# Altium project MotherBoard.PrjPcb (part 1 of 2)
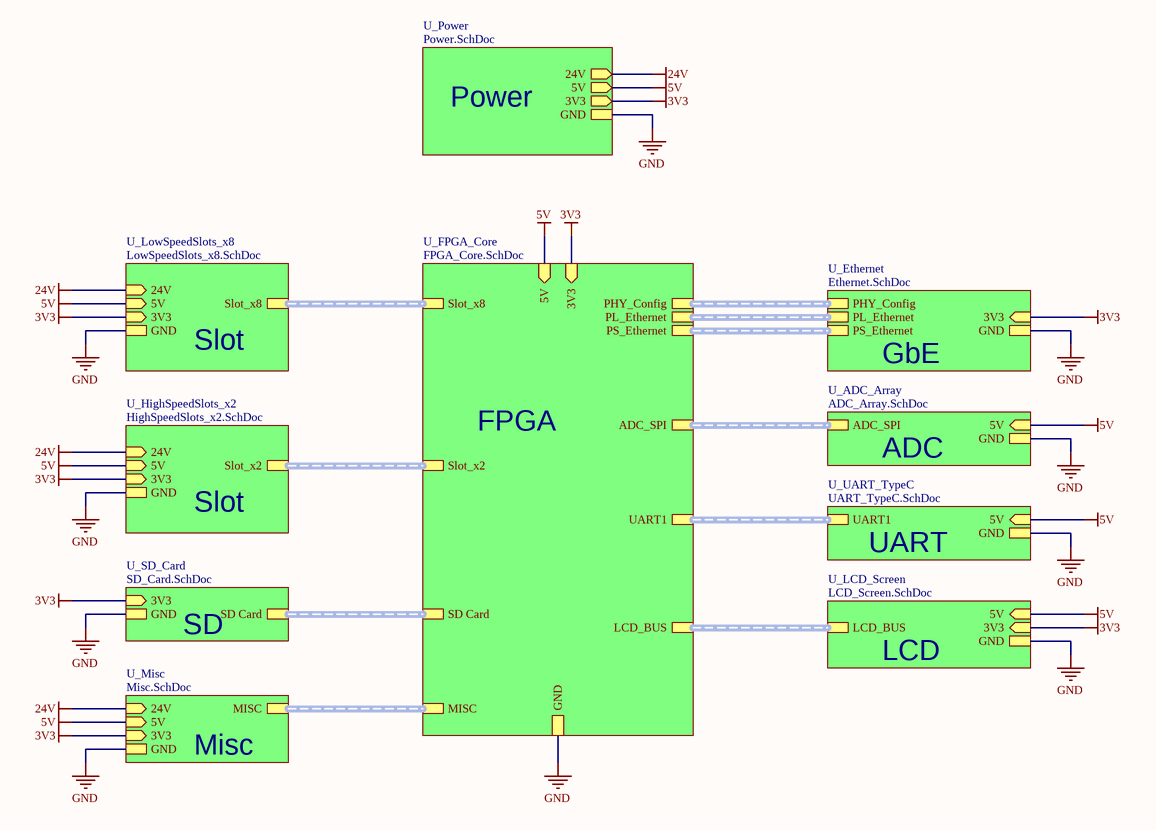
[diagram p0: MotherBoard.SchDoc]
Version: 1.1 (TO); RepoURL: https://github.com/hkust-fiona/fiona-hardware.git; Project: FIONA Toolchain (Mother Board); License: Light the Way Forward :D; DescriptionLine2: hkust-fiona/; DescriptionLine1: https://github.com/; Date: Aug 31, 2022; Author: Yinyi (Shannon) LIU
16 sheets, 213 parts. Net scope: strictly hierarchical (ports join the sheet entries above them; power ports are local).
Board file: PCB_MotherBoard.PcbDoc
Sheets:
  MotherBoard.SchDoc
    U_Power = Power.SchDoc
      U_24V_Supply = 24V_Supply.SchDoc
      U_5V_and_3V3 = 5V_and_3V3.SchDoc
    U_LowSpeedSlots_x8 = LowSpeedSlots_x8.SchDoc
      U_CardSlot1 = CardSlot.SchDoc
      U_CardSlot2 = CardSlot.SchDoc
      U_CardSlot3 = CardSlot.SchDoc
      U_CardSlot4 = CardSlot.SchDoc
      U_CardSlot5 = CardSlot.SchDoc
      U_CardSlot6 = CardSlot.SchDoc
      U_CardSlot7 = CardSlot.SchDoc
      U_CardSlot8 = CardSlot.SchDoc
    U_HighSpeedSlots_x2 = HighSpeedSlots_x2.SchDoc
      U_CardSlot9 = CardSlot.SchDoc
      U_CardSlot10 = CardSlot.SchDoc
    U_FPGA_Core = FPGA_Core.SchDoc
    U_Ethernet = Ethernet.SchDoc
      U_PS_RJ45 = PS_RJ45.SchDoc
      U_PL_PHY_RJ45 = PL_PHY_RJ45.SchDoc
    U_ADC_Array = ADC_Array.SchDoc
    U_UART_TypeC = UART_TypeC.SchDoc
    U_SD_Card = SD_Card.SchDoc
    U_LCD_Screen = LCD_Screen.SchDoc
    U_Misc = Misc.SchDoc

## Sheet MotherBoard.SchDoc: Mother Board
size A4; ENG_APP_DATE: --/--/--; DSN_APP_DATE: --/--/--; CHK_APP_DATE: --/--/--; DocumentNumber: 1; SheetNumber: 1; SheetTotal: 16

### Sub-sheets
U_ADC_Array = ADC_Array.SchDoc: ADC_SPI (harness ADC SPI), 5V (in), GND
U_Ethernet = Ethernet.SchDoc: GND, 3V3 (in), PS_Ethernet, PHY_Config, PL_Ethernet
U_FPGA_Core = FPGA_Core.SchDoc: Slot_x2 (harness Slot x2), Slot_x8 (harness Slot x8), PHY_Config (harness PHY Config), PS_Ethernet (harness PS Ethernet), PL_Ethernet (harness PL Ethernet), 5V (in), GND, ADC_SPI (harness ADC SPI), 3V3 (in), UART1 (harness UART1), SD Card (harness SD CARD), LCD_BUS (harness LCD BUS), MISC (harness Misc)
U_HighSpeedSlots_x2 = HighSpeedSlots_x2.SchDoc: Slot_x2 (harness Slot x2), 24V (in), 5V (in), GND, 3V3 (in)
U_LCD_Screen = LCD_Screen.SchDoc: 3V3 (in), GND, LCD_BUS (harness LCD BUS), 5V (in)
U_LowSpeedSlots_x8 = LowSpeedSlots_x8.SchDoc: 24V (in), 5V (in), GND, Slot_x8 (harness Slot x8), 3V3 (in)
U_Misc = Misc.SchDoc: 3V3 (in), GND, MISC (harness Misc), 24V (in), 5V (in)
U_Power = Power.SchDoc: 24V (out), 5V (out), 3V3 (out), GND
U_SD_Card = SD_Card.SchDoc: SD Card (harness SD CARD), GND, 3V3 (in)
U_UART_TypeC = UART_TypeC.SchDoc: UART1 (harness UART1), 5V (in), GND

### Nets
3V3: sheet U_Power/3V3, sheet U_LowSpeedSlots_x8/3V3, sheet U_HighSpeedSlots_x2/3V3, sheet U_FPGA_Core/3V3, sheet U_Ethernet/3V3, sheet U_SD_Card/3V3, sheet U_LCD_Screen/3V3, sheet U_Misc/3V3
5V: sheet U_Power/5V, sheet U_LowSpeedSlots_x8/5V, sheet U_HighSpeedSlots_x2/5V, sheet U_FPGA_Core/5V, sheet U_ADC_Array/5V, sheet U_UART_TypeC/5V, sheet U_LCD_Screen/5V, sheet U_Misc/5V
24V: sheet U_Power/24V, sheet U_LowSpeedSlots_x8/24V, sheet U_HighSpeedSlots_x2/24V, sheet U_Misc/24V
GND: sheet U_Power/GND, sheet U_LowSpeedSlots_x8/GND, sheet U_HighSpeedSlots_x2/GND, sheet U_FPGA_Core/GND, sheet U_Ethernet/GND, sheet U_ADC_Array/GND, sheet U_UART_TypeC/GND, sheet U_SD_Card/GND, sheet U_LCD_Screen/GND, sheet U_Misc/GND

### Buses and harness runs
harness sheet U_ADC_Array/ADC_SPI = sheet U_FPGA_Core/ADC_SPI
harness sheet U_Ethernet/PHY_Config = sheet U_FPGA_Core/PHY_Config
harness sheet U_Ethernet/PL_Ethernet = sheet U_FPGA_Core/PL_Ethernet
harness sheet U_Ethernet/PS_Ethernet = sheet U_FPGA_Core/PS_Ethernet
harness sheet U_FPGA_Core/LCD_BUS = sheet U_LCD_Screen/LCD_BUS
harness sheet U_FPGA_Core/MISC = sheet U_Misc/MISC
harness sheet U_FPGA_Core/SD Card = sheet U_SD_Card/SD Card
harness sheet U_FPGA_Core/Slot_x2 = sheet U_HighSpeedSlots_x2/Slot_x2
harness sheet U_FPGA_Core/Slot_x8 = sheet U_LowSpeedSlots_x8/Slot_x8
harness sheet U_FPGA_Core/UART1 = sheet U_UART_TypeC/UART1

### Notes on the sheet
- Power
- Slot
- GbE
- FPGA
- ADC
- UART
- SD
- OLED
- LCD
- Misc
- Title
- FileName:
- Version:
- Date:
- Project
- Designed By:
- Descriptions:
- Sheet:
- of

## Sheet Power.SchDoc: Power Supply and Regulator Module
size A4; DocumentNumber: 2; SheetNumber: 2; SheetTotal: 16
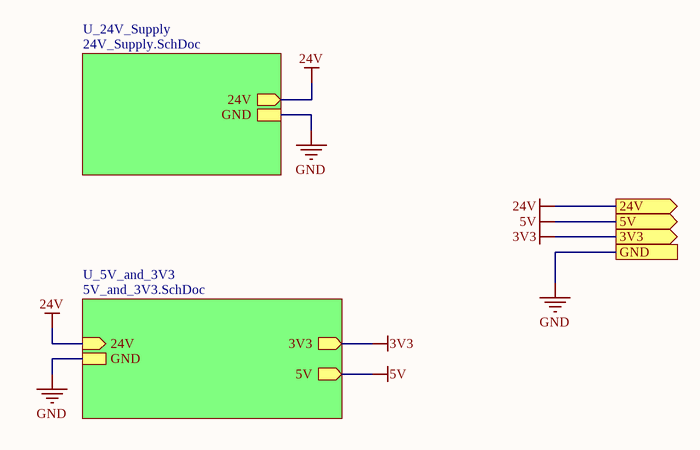
[diagram p1: Power.SchDoc]

### Sub-sheets
U_5V_and_3V3 = 5V_and_3V3.SchDoc: 24V (in), GND, 3V3 (out), 5V (out)
U_24V_Supply = 24V_Supply.SchDoc: 24V (out), GND

### Ports
3V3 (out), 5V (out), 24V (out), GND

### Nets
3V3: port 3V3, sheet U_5V_and_3V3/3V3
5V: port 5V, sheet U_5V_and_3V3/5V
24V: port 24V, sheet U_24V_Supply/24V, sheet U_5V_and_3V3/24V
GND: port GND, sheet U_24V_Supply/GND, sheet U_5V_and_3V3/GND

### Notes on the sheet
- Title
- FileName:
- Version:
- Date:
- Project
- Designed By:
- Descriptions:
- Sheet:
- of

## Sheet 24V_Supply.SchDoc: 24V Power Jack Input with PMOS Switch
size A4; DocumentNumber: 3; SheetNumber: 3; SheetTotal: 16
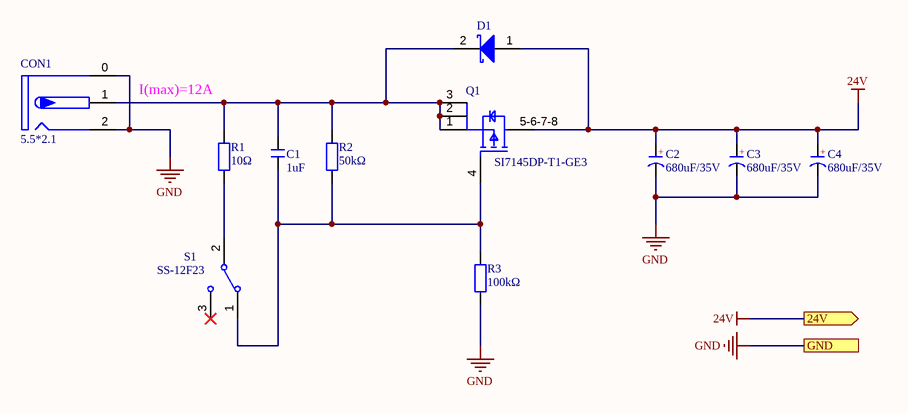
[diagram p2: 24V_Supply.SchDoc]

### Parts
C1  1uF  [C 0603_L]
C2  680uF/35V  [CM G(12.5*13.5)]
C3  680uF/35V  [CM G(12.5*13.5)]
C4  680uF/35V  [CM G(12.5*13.5)]
CON1  5.5*2.1  [DC-005P]
D1  B530C-13-F  [DIOD-SMC-2_V]  (value not drawn)
Q1  SI7145DP-T1-GE3  [FP-S17-0173-SINGLE-MFG]
R1  10Ω  [R 0603_L]
R2  50kΩ  [R 0603_L]
R3  100kΩ  [R 0603_L]
S1  SS-12F23  [SS-SG2]

### Ports
24V (out), GND

### Nets
24V: C2.1(A) C3.1(A) C4.1(A) D1.1(A) Q1.5-6-7-8(D) ; port 24V
GND: C2.2(K) C3.2(K) C4.2(K) CON1.0 CON1.2 R3.1 ; port GND
NetC1_1: C1.1 Q1.4(G) R2.1 R3.2 S1.1
NetC1_2: C1.2 CON1.1 D1.2(K) Q1.1(S) Q1.2(S) Q1.3(S) R1.2 R2.2
NetR1_1: R1.1 S1.2

Not connected (* = marked no-connect by the designer): S1 3*

### Notes on the sheet
- I(max)=12A
- Title
- FileName:
- Version:
- Date:
- Project
- Designed By:
- Descriptions:
- Sheet:
- of
- (in symbol CE_SMD) +

### Library data of the parts
C1 = C: 贴片电容; BOM名称: 无极性贴片电容; 淘宝ID: 封装库来自淘宝 ID：黄晶宝石; 联系售后，技术支持: https://shop463601444.taobao.com; 唯一出售店铺网址: https://shop463601444.taobao.com
C2-C4 = CE_SMD: 贴片电解电容; 版权归属: 封装库来自淘宝 ID：黄晶宝石; BOM名称: 贴片电解电容; 联系售后: https://shop463601444.taobao.com
CON1 = DC-005P: 带屏蔽DC电源接口 / *LCID: C3001296; BOM名称: 带屏蔽DC电源接口; 学习资源: https://shop463601444.taobao.com
D1 = CMP-1693-00001-3: Surface Mount Schottky Barrier Rectifier, 5 A, 0.55 V, -55 to 150 degC, 2-Pin SMD, RoHS, Tape and Reel / *LCID: C110488; Mounting Technology: Surface Mount; DatasheetVersion: Rev. 16-2; ComponentLink2URL: http://www.diodes.com/_files/datasheets/ds13012.pdf; ComponentLink1Description: Manufacturer URL; ComponentLink1URL: http://www.diodes.com/; ComponentLink2Description: Datasheet; PartNumber: B530C-13-F; PackageDescription: 2-Pin Surface Mount Device, Body 5.905 x 6.855 mm; Max Operating Temperature: 125 degC; Radiation Hardening: No; Mount: Surface Mount; Height: 2.3 mm; REACH SVHC: No SVHC; Packaging: Tape and Reel; Min Operating Temperature: -55 degC; Length: 7.11 mm; Package Quantity: 3000; Width: 6.22 mm; Case/Package: SMC; Pins: 2; RoHSCompliant: True
Q1 = CMP-2000-07061-2: MOSFET P-CH 30V 60A PPAK SO-8 / *LCID: C725172; Manufacturer: Vishay; Gate Charge At Vgs: 275nC @ -10V; Turn On Delay Time: 27ns; Number Of P Channels: 1; Max Forward Diode Voltage: -1.1V; Pulse Drain Current: -100A; Gate To Source Voltage: 20V; Threshold Vgs Max: -2.3V; Drain To Source Resistance: 0.0021Ω; Threshold Vgs Min: -1V; Input Capacitace At Vds: 15660pF @ -15V; Power Dissipation: 6.25W; Standoff Height: 0mm; Continuous Drain Current: -36.5A; Max Junction Temp: +150°C; Typ Forward Diode Voltage: -0.69V; Turn Off Delay Time: 130ns; Drain To Source Breakdown Voltage: -30V; Reverse Recovery Time: 42ns; Depletion Mode: False; Reverse Recovery Charge: 44nC; Rthja Max: 15°C/W; Transconductance: 110S; Temperature Range Low: -55°C; Manufacturer Part Number: SI7145DP-T1-GE3; Height: 1.17mm; Automotive: No; Device Class L2: Transistors; Octopart: https://octopart.com/si7145dp-t1-ge3-vishay-42623172; RoHS: TRUE; Device Class L3: MOSFETs; ComponentLink2URL: http://www.vishay.com/docs/64814/si7145dp.pdf; Mouser Description: Single P-Channel 30 V 2.6 mOhms Surface Mount Power Mosfet - PowerPAK SO-8; ComponentLink2Description: Datasheet; Category: Trans; Digikey Description: MOSFET P-CH 30V 60A PPAK SO-8; Number Of Channels: 1; Package: S17-0173-SINGLE; Device Class L1: Discrete Semiconductors; Drain To Source Voltage: -30V; Temperature Range High: +150°C; Temperature: -55°C to +150°C; Lead Free: Yes
R1-R3 = R: 贴片电阻; 版权归属: 来自淘宝 ID：黄晶宝石; 封装库来自淘宝卖家 ID：黄晶宝石: 其他店铺购入均为盗版，不享受售后技术支持服务，请立即申请退款; BOM名称: 贴片电阻; 联系售后: https://shop463601444.taobao.com
S1 = SSW-1P: 1路波动开关 / *LCID: C480340; BOM名称: 波动开关; 版权归属: 封装库来自淘宝 ID：黄晶宝石; 学习资源: https://shop463601444.taobao.com

## Sheet 5V_and_3V3.SchDoc: 5V 3A and 3.3V 1A Output
size A4; DocumentNumber: 4; SheetNumber: 4; SheetTotal: 16
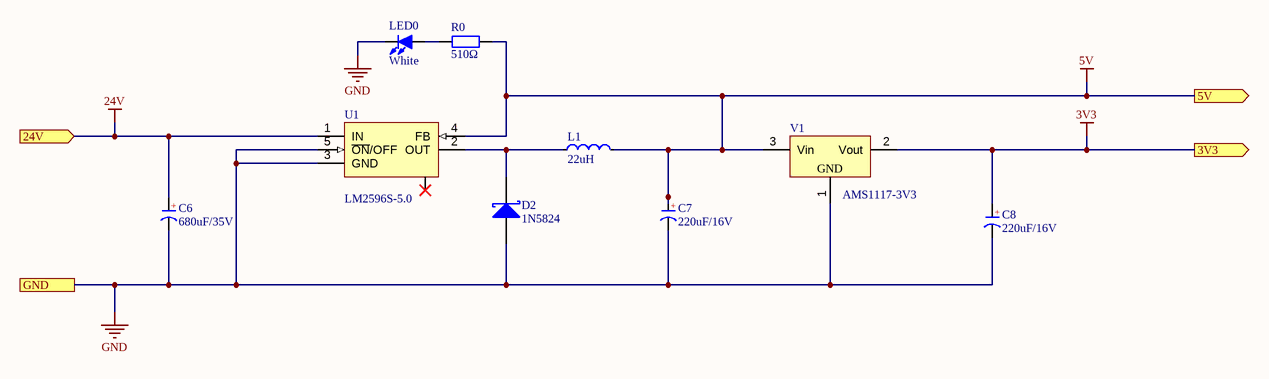
[diagram p3: 5V_and_3V3.SchDoc]

### Parts
C6  680uF/35V  [CM G(12.5*13.5)]
C7  220uF/16V  [CM D(6.3*7.7)]
C8  220uF/16V  [CM D(6.3*7.7)]
D2  1N5824  [SMA]
L1  Inductance: 22uH  [SMD-11.5x10.5]  (hidden comment: InductanceSMD)
LED0  White  [LED 0603W]
R0  510Ω  [R 0603_L]
U1  LM2596S-5.0  [TO263-5A]
V1  AMS1117-3V3  [SOT223_L]

### Ports
3V3 (out), 5V (out), 24V (in), GND

### Nets
3V3: C8.1(A) V1.2(Vout) ; port 3V3
5V: C7.1(A) L1.2 R0.1 U1.4(FB) V1.3(Vin) ; port 5V
24V: C6.1(A) U1.1(IN) ; port 24V
GND: C6.2(K) C7.2(K) C8.2(K) D2.1(A) LED0.2(K) U1.3(GND) U1.5(~{ON}/OFF) V1.1(GND) ; port GND
NetD2_2: D2.2(K) L1.1 U1.2(OUT)
NetLED0_1: LED0.1(A) R0.2

Not connected (* = marked no-connect by the designer): U1 6*

### Notes on the sheet
- Title
- FileName:
- Version:
- Date:
- Project
- Designed By:
- Descriptions:
- Sheet:
- of
- (in symbol CE_SMD) +

### Library data of the parts
C6 = CE_SMD: 贴片电解电容; 版权归属: 封装库来自淘宝 ID：黄晶宝石; BOM名称: 贴片电解电容; 联系售后: https://shop463601444.taobao.com
C7 C8 = CE_SMD: 贴片电解电容 C4054381; 版权归属: 封装库来自淘宝 ID：黄晶宝石; BOM名称: 贴片电解电容; 联系售后: https://shop463601444.taobao.com
D2 = SS14: 肖特基二极管; 属性: 40V/1A; BOM名称: 肖特基二极管; 封装库来自淘宝 ID：黄晶宝石: https://shop463601444.taobao.com
L1 = InductanceSMD: C280568 / (MHCC10040-330M-R7)
LED0 = LED-SMD: 贴片LED; 版权归属: 封装库来自淘宝 ID：黄晶宝石; BOM名称: 贴片LED; 学习资源: https://shop463601444.taobao.com
R0 = R: as R1 on sheet 24V_Supply; BOM名称: 贴片电阻; 联系售后: https://shop463601444.taobao.com
U1 = LM2596S-5.0: 5V稳压芯片; Note: Tab is connected to GND; Published: 15-Apr-2002; DatasheetVersion: Dec-1997; PackageReference: TS5B; Publisher: Altium Limited; PackageDescription: D2-PAK; 5 Leads; Body 14.4 (inc. leads) x 10.4 mm (LxW max); ComponentLink1Description: Manufacturer Link; ComponentLink1URL: http://www.national.com/; ComponentLink2Description: Datasheet; ComponentLink2URL: http://www.national.com/ds.cgi/LM/LM2596.pdf; ComponentLink3Description: URL Link1; ComponentLink3URL: http://www.national.com/pf/LM/LM2596.html
V1 = AMS1117: 三端稳压芯片; BOM名称: 稳压芯片; 淘宝ID: 封装库来自淘宝 ID：黄晶宝石; 欢迎光临淘宝店铺: https://shop463601444.taobao.com

## Sheet LowSpeedSlots_x8.SchDoc: 8-Channel Low-Speed Slots for DA-Card
size A4; DocumentNumber: 6; SheetNumber: 6; SheetTotal: 16
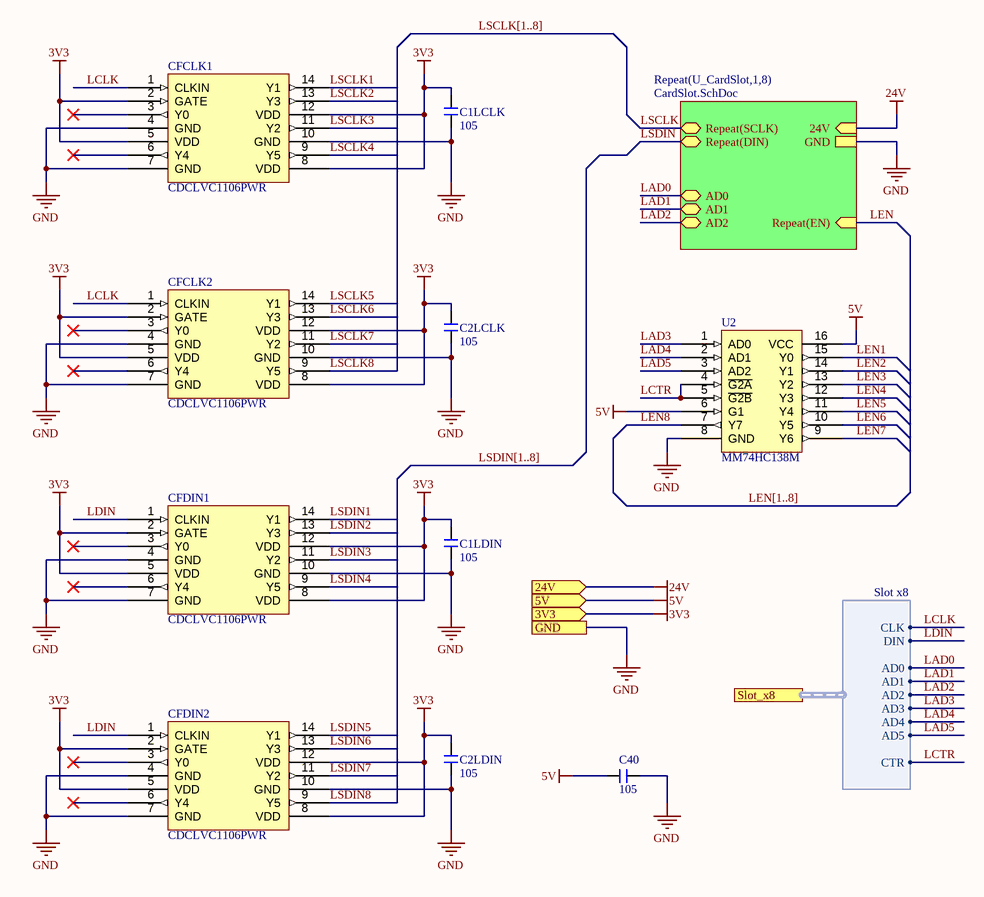
[diagram p4: LowSpeedSlots_x8.SchDoc]

### Parts
C1LCLK  105  [C 0603_L]
C1LDIN  105  [C 0603_L]
C2LCLK  105  [C 0603_L]
C2LDIN  105  [C 0603_L]
C40  105  [C 0603_L]
CFCLK1  CDCLVC1106PWR  [TSSOP14_L]
CFCLK2  CDCLVC1106PWR  [TSSOP14_L]
CFDIN1  CDCLVC1106PWR  [TSSOP14_L]
CFDIN2  CDCLVC1106PWR  [TSSOP14_L]
U2  MM74HC138M  [SO16NB]

### Sub-sheets
Repeat(U_CardSlot,1,8) = CardSlot.SchDoc: 24V (in), GND, Repeat(SCLK) (bidir), Repeat(DIN) (bidir), AD0 (bidir), AD1 (bidir), AD2 (bidir), Repeat(EN) (in)

### Ports
3V3 (in), 5V (in), 24V (in), GND, Slot_x8 (harness Slot x8)

### Harnesses
Slot x8: CLK, DIN, AD0, AD1, AD2, AD3, AD4, AD5, CTR

### Nets
3V3: C1LCLK.2 C1LDIN.2 C2LCLK.2 C2LDIN.2 CFCLK1.2(GATE) CFCLK1.5(VDD) CFCLK1.8(VDD) CFCLK1.12(VDD) CFCLK2.2(GATE) CFCLK2.5(VDD) CFCLK2.8(VDD) CFCLK2.12(VDD) CFDIN1.2(GATE) CFDIN1.5(VDD) CFDIN1.8(VDD) CFDIN1.12(VDD) CFDIN2.2(GATE) CFDIN2.5(VDD) CFDIN2.8(VDD) CFDIN2.12(VDD) ; port 3V3
5V: C40.2 U2.6(G1) U2.16(VCC) ; port 5V
24V: port 24V, sheet Repeat(U_CardSlot,1,8)/24V
GND: C1LCLK.1 C1LDIN.1 C2LCLK.1 C2LDIN.1 C40.1 CFCLK1.4(GND) CFCLK1.7(GND) CFCLK1.10(GND) CFCLK2.4(GND) CFCLK2.7(GND) CFCLK2.10(GND) CFDIN1.4(GND) CFDIN1.7(GND) CFDIN1.10(GND) CFDIN2.4(GND) CFDIN2.7(GND) CFDIN2.10(GND) U2.8(GND) ; port GND, sheet Repeat(U_CardSlot,1,8)/GND
LAD0: sheet Repeat(U_CardSlot,1,8)/AD0, port Slot_x8.AD0
LAD1: sheet Repeat(U_CardSlot,1,8)/AD1, port Slot_x8.AD1
LAD2: sheet Repeat(U_CardSlot,1,8)/AD2, port Slot_x8.AD2
LAD3: U2.1(AD0) ; port Slot_x8.AD3
LAD4: U2.2(AD1) ; port Slot_x8.AD4
LAD5: U2.3(AD2) ; port Slot_x8.AD5
LCLK: CFCLK1.1(CLKIN) CFCLK2.1(CLKIN) ; port Slot_x8.CLK
LCTR: U2.4(~{G2A}) U2.5(~{G2B}) ; port Slot_x8.CTR
LDIN: CFDIN1.1(CLKIN) CFDIN2.1(CLKIN) ; port Slot_x8.DIN
LEN: sheet Repeat(U_CardSlot,1,8)/Repeat(EN)
LEN1: U2.15(Y0)
LEN2: U2.14(Y1)
LEN3: U2.13(Y2)
LEN4: U2.12(Y3)
LEN5: U2.11(Y4)
LEN6: U2.10(Y5)
LEN7: U2.9(Y6)
LEN8: U2.7(Y7)
LSCLK: sheet Repeat(U_CardSlot,1,8)/Repeat(SCLK)
LSCLK1: CFCLK1.14(Y1)
LSCLK2: CFCLK1.13(Y3)
LSCLK3: CFCLK1.11(Y2)
LSCLK4: CFCLK1.9(Y5)
LSCLK5: CFCLK2.14(Y1)
LSCLK6: CFCLK2.13(Y3)
LSCLK7: CFCLK2.11(Y2)
LSCLK8: CFCLK2.9(Y5)
LSDIN: sheet Repeat(U_CardSlot,1,8)/Repeat(DIN)
LSDIN1: CFDIN1.14(Y1)
LSDIN2: CFDIN1.13(Y3)
LSDIN3: CFDIN1.11(Y2)
LSDIN4: CFDIN1.9(Y5)
LSDIN5: CFDIN2.14(Y1)
LSDIN6: CFDIN2.13(Y3)
LSDIN7: CFDIN2.11(Y2)
LSDIN8: CFDIN2.9(Y5)

Not connected (* = marked no-connect by the designer): CFCLK1 3(Y0)* 6(Y4)*; CFCLK2 3(Y0)* 6(Y4)*; CFDIN1 3(Y0)* 6(Y4)*; CFDIN2 3(Y0)* 6(Y4)*

### Buses and harness runs
bus LEN[1..8]
bus LSCLK[1..8]
bus LSDIN[1..8]

### Notes on the sheet
- Title
- FileName:
- Version:
- Date:
- Project
- Designed By:
- Descriptions:
- Sheet:
- of

### Library data of the parts
C1LCLK C1LDIN C2LCLK C2LDIN C40 = C: as C1 on sheet 24V_Supply; 联系售后，技术支持: https://shop463601444.taobao.com; 唯一出售店铺网址: https://shop463601444.taobao.com
CFCLK1 CFCLK2 CFDIN1 CFDIN2 = CDCLVC1106PWR: 1:6 Clock Fan-out Buffer
U2 = MM74HC138M: 3-to-8 Decoder

## Sheet CardSlot.SchDoc: Slot for DA-Card
size A4; DocumentNumber: 5; SheetNumber: 5; SheetTotal: 16
Used 10 times, as channels U_LowSpeedSlots_x8/U_CardSlot1, U_LowSpeedSlots_x8/U_CardSlot2, U_LowSpeedSlots_x8/U_CardSlot3, U_LowSpeedSlots_x8/U_CardSlot4, U_LowSpeedSlots_x8/U_CardSlot5, U_LowSpeedSlots_x8/U_CardSlot6, U_LowSpeedSlots_x8/U_CardSlot7, U_LowSpeedSlots_x8/U_CardSlot8, U_HighSpeedSlots_x2/U_CardSlot9, U_HighSpeedSlots_x2/U_CardSlot10. Parts and nets are listed once, with the designators drawn on the sheet.
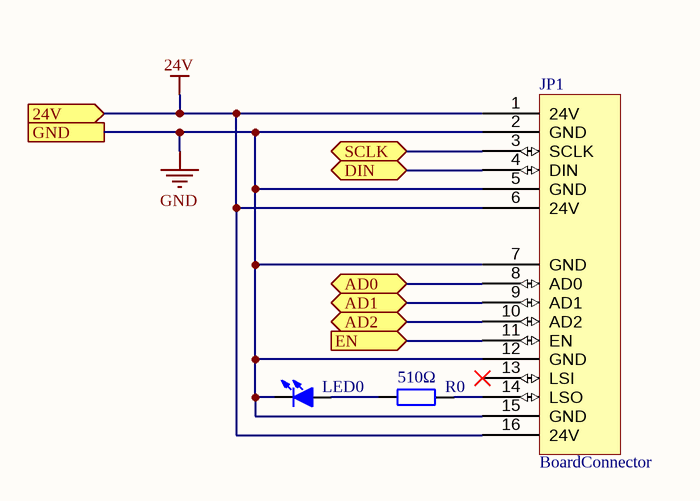
[diagram p5: CardSlot.SchDoc]

### Parts
JP1  BoardConnector  [HDR2.54-DIY16-N]
LED0  White  [LED 0603W]  (value not drawn)
R0  510Ω  [R 0603_L]

### Ports
24V (in), AD0 (bidir), AD1 (bidir), AD2 (bidir), DIN (bidir), EN (in), GND, SCLK (bidir)

### Nets
24V: JP1.1(24V) JP1.6(24V) JP1.16(24V) ; port 24V
GND: JP1.2(GND) JP1.5(GND) JP1.7(GND) JP1.12(GND) JP1.15(GND) LED0.2(K) ; port GND
AD0: JP1.8(AD0) ; port AD0
AD1: JP1.9(AD1) ; port AD1
AD2: JP1.10(AD2) ; port AD2
DIN: JP1.4(DIN) ; port DIN
EN: JP1.11(EN) ; port EN
SCLK: JP1.3(SCLK) ; port SCLK
NetJP1_14: JP1.14(LSO) R0.2
NetLED0_1: LED0.1(A) R0.1

Not connected (* = marked no-connect by the designer): JP1 13(LSI)*

### Channels
U_LowSpeedSlots_x8/U_CardSlot1: designators end in _U_CardSlot1; ports 24V=24V AD0=LAD0 AD1=LAD1 AD2=LAD2 DIN=LSDIN1 EN=LEN1 GND=GND SCLK=LSCLK1
U_LowSpeedSlots_x8/U_CardSlot2: designators end in _U_CardSlot2; ports 24V=24V AD0=LAD0 AD1=LAD1 AD2=LAD2 DIN=LSDIN2 EN=LEN2 GND=GND SCLK=LSCLK2
U_LowSpeedSlots_x8/U_CardSlot3: designators end in _U_CardSlot3; ports 24V=24V AD0=LAD0 AD1=LAD1 AD2=LAD2 DIN=LSDIN3 EN=LEN3 GND=GND SCLK=LSCLK3
U_LowSpeedSlots_x8/U_CardSlot4: designators end in _U_CardSlot4; ports 24V=24V AD0=LAD0 AD1=LAD1 AD2=LAD2 DIN=LSDIN4 EN=LEN4 GND=GND SCLK=LSCLK4
U_LowSpeedSlots_x8/U_CardSlot5: designators end in _U_CardSlot5; ports 24V=24V AD0=LAD0 AD1=LAD1 AD2=LAD2 DIN=LSDIN5 EN=LEN5 GND=GND SCLK=LSCLK5
U_LowSpeedSlots_x8/U_CardSlot6: designators end in _U_CardSlot6; ports 24V=24V AD0=LAD0 AD1=LAD1 AD2=LAD2 DIN=LSDIN6 EN=LEN6 GND=GND SCLK=LSCLK6
U_LowSpeedSlots_x8/U_CardSlot7: designators end in _U_CardSlot7; ports 24V=24V AD0=LAD0 AD1=LAD1 AD2=LAD2 DIN=LSDIN7 EN=LEN7 GND=GND SCLK=LSCLK7
U_LowSpeedSlots_x8/U_CardSlot8: designators end in _U_CardSlot8; ports 24V=24V AD0=LAD0 AD1=LAD1 AD2=LAD2 DIN=LSDIN8 EN=LEN8 GND=GND SCLK=LSCLK8
U_HighSpeedSlots_x2/U_CardSlot9: designators end in _U_CardSlot9; ports 24V=24V AD0=HAD0 AD1=HAD1 AD2=HAD2 DIN=HSDIN9 EN=HEN9 GND=GND SCLK=HSCLK9
U_HighSpeedSlots_x2/U_CardSlot10: designators end in _U_CardSlot10; ports 24V=24V AD0=HAD0 AD1=HAD1 AD2=HAD2 DIN=HSDIN10 EN=HEN10 GND=GND SCLK=HSCLK10

### Notes on the sheet
- Title
- FileName:
- Version:
- Date:
- Project
- Designed By:
- Descriptions:
- Sheet:
- of

### Library data of the parts
JP1 = BoardConnector: DIY Board Connector (P/N); System: Connector
LED0 = LED-SMD: 贴片LED; 版权归属: 封装库来自淘宝 ID：黄晶宝石; BOM名称: 贴片LED; 学习资源: https://shop463601444.taobao.com
R0 = R: as R1 on sheet 24V_Supply; BOM名称: 贴片电阻; 联系售后: https://shop463601444.taobao.com

## Sheet HighSpeedSlots_x2.SchDoc: 2-Channel High-Speed Slots for DA-Card
size A4; DocumentNumber: 7; SheetNumber: 7; SheetTotal: 16
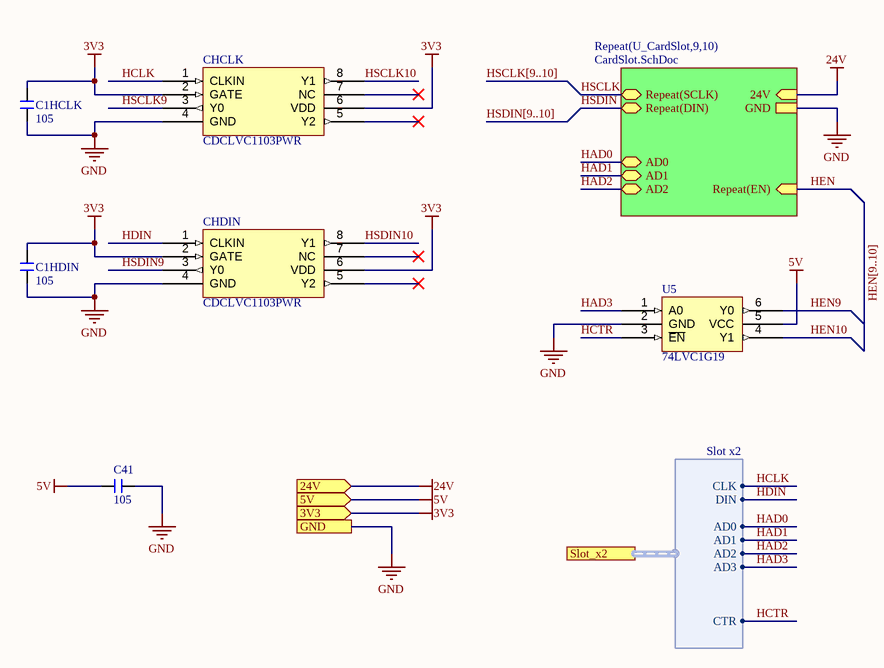
[diagram p6: HighSpeedSlots_x2.SchDoc]

### Parts
C1HCLK  105  [C 0603_L]
C1HDIN  105  [C 0603_L]
C41  105  [C 0603_L]
CHCLK  CDCLVC1103PWR  [TSSOP-8-3mm]
CHDIN  CDCLVC1103PWR  [TSSOP-8-3mm]
U5  74LVC1G19  [SOT23-6]

### Sub-sheets
Repeat(U_CardSlot,9,10) = CardSlot.SchDoc: 24V (in), GND, Repeat(SCLK) (bidir), Repeat(DIN) (bidir), AD0 (bidir), AD1 (bidir), AD2 (bidir), Repeat(EN) (in)

### Ports
3V3 (in), 5V (in), 24V (in), GND, Slot_x2 (harness Slot x2)

### Harnesses
Slot x2: CLK, DIN, AD0, AD1, AD2, AD3, CTR

### Nets
3V3: C1HCLK.2 C1HDIN.2 CHCLK.2(GATE) CHCLK.6(VDD) CHDIN.2(GATE) CHDIN.6(VDD) ; port 3V3
5V: C41.2 U5.5(VCC) ; port 5V
24V: port 24V, sheet Repeat(U_CardSlot,9,10)/24V
GND: C1HCLK.1 C1HDIN.1 C41.1 CHCLK.4(GND) CHDIN.4(GND) U5.2(GND) ; port GND, sheet Repeat(U_CardSlot,9,10)/GND
HAD0: sheet Repeat(U_CardSlot,9,10)/AD0, port Slot_x2.AD0
HAD1: sheet Repeat(U_CardSlot,9,10)/AD1, port Slot_x2.AD1
HAD2: sheet Repeat(U_CardSlot,9,10)/AD2, port Slot_x2.AD2
HAD3: U5.1(A0) ; port Slot_x2.AD3
HCLK: CHCLK.1(CLKIN) ; port Slot_x2.CLK
HCTR: U5.3(~{EN}) ; port Slot_x2.CTR
HDIN: CHDIN.1(CLKIN) ; port Slot_x2.DIN
HEN: sheet Repeat(U_CardSlot,9,10)/Repeat(EN)
HEN9: U5.6(Y0)
HEN10: U5.4(Y1)
HSCLK: sheet Repeat(U_CardSlot,9,10)/Repeat(SCLK)
HSCLK9: CHCLK.3(Y0)
HSCLK10: CHCLK.8(Y1)
HSDIN: sheet Repeat(U_CardSlot,9,10)/Repeat(DIN)
HSDIN9: CHDIN.3(Y0)
HSDIN10: CHDIN.8(Y1)

Not connected (* = marked no-connect by the designer): CHCLK 5(Y2)* 7(NC)*; CHDIN 5(Y2)* 7(NC)*

### Buses and harness runs
bus HEN[9..10]
bus HSCLK[9..10]
bus HSDIN[9..10]

### Notes on the sheet
- Title
- FileName:
- Version:
- Date:
- Project
- Designed By:
- Descriptions:
- Sheet:
- of

### Library data of the parts
C1HCLK C1HDIN C41 = C: as C1 on sheet 24V_Supply; 联系售后，技术支持: https://shop463601444.taobao.com; 唯一出售店铺网址: https://shop463601444.taobao.com
CHCLK CHDIN = CDCLVC1103PWR: 1:3 Clock Fan-out Buffer
U5 = 74LVC1G19: 1-to-2 Decoder ActiveLow C58923

## Sheet FPGA_Core.SchDoc: FPGA Core Module
size 420 x 297 mm; DocumentNumber: 8; SheetNumber: 8; SheetTotal: 16
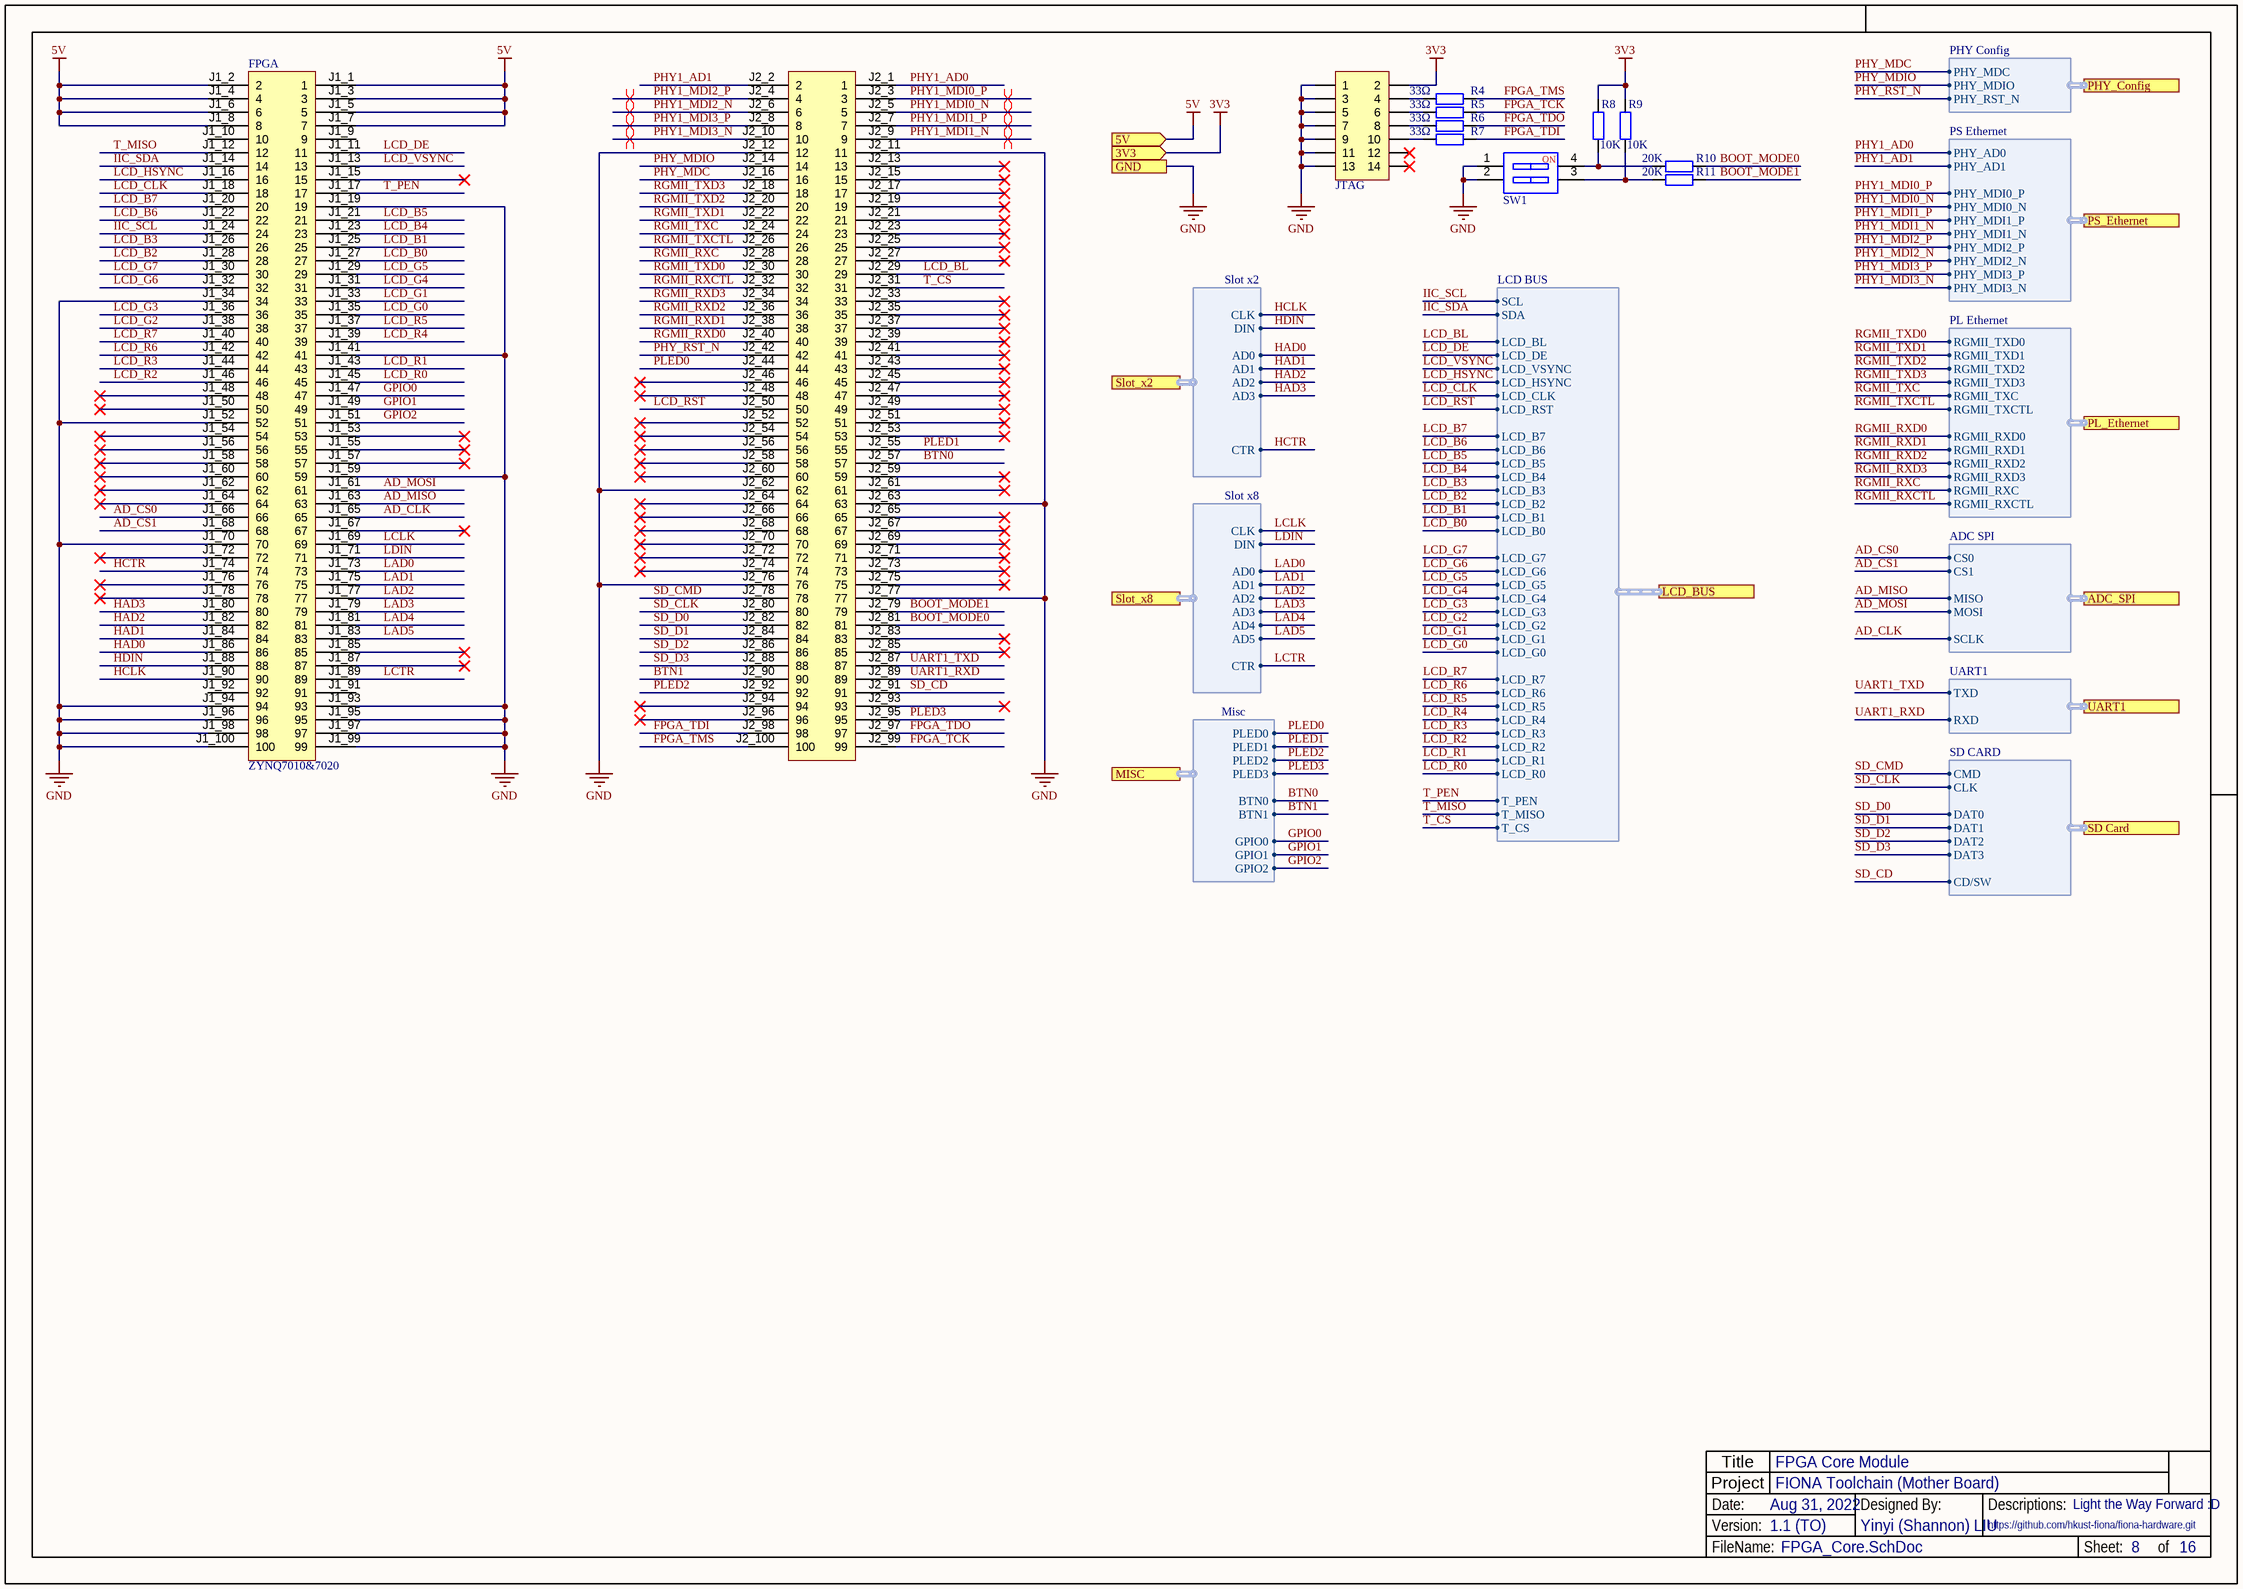
[diagram p7: FPGA_Core.SchDoc]

### Parts
FPGA  ZYNQ7010&7020  [ZYNQ7010&7020_CB]
JTAG  Header 2X7  [IDC2.54-LI-2x7P]  (value not drawn)
R4  33Ω  [R 0603_L]
R5  33Ω  [R 0603_L]
R6  33Ω  [R 0603_L]
R7  33Ω  [R 0603_L]
R8  10K  [R 0603_L]
R9  10K  [R 0603_L]
R10  20K  [R 0603_L]
R11  20K  [R 0603_L]
SW1  SW-2P  [CSW DIP-2P]  (value not drawn)

### Ports
3V3 (in), 5V (in), ADC_SPI (harness ADC SPI), GND, LCD_BUS (harness LCD BUS), MISC (harness Misc), PHY_Config (harness PHY Config), PL_Ethernet (harness PL Ethernet), PS_Ethernet (harness PS Ethernet), SD Card (harness SD CARD), Slot_x2 (harness Slot x2), Slot_x8 (harness Slot x8), UART1 (harness UART1)

### Harnesses
Slot x2: CLK, DIN, AD0, AD1, AD2, AD3, CTR
Slot x8: CLK, DIN, AD0, AD1, AD2, AD3, AD4, AD5, CTR
PHY Config: PHY_MDC, PHY_MDIO, PHY_RST_N
PS Ethernet: PHY_AD0, PHY_AD1, PHY_MDI0_P, PHY_MDI0_N, PHY_MDI1_P, PHY_MDI1_N, PHY_MDI2_P, PHY_MDI2_N, PHY_MDI3_P, PHY_MDI3_N
PL Ethernet: RGMII_TXD0, RGMII_TXD1, RGMII_TXD2, RGMII_TXD3, RGMII_TXC, RGMII_TXCTL, RGMII_RXD0, RGMII_RXD1, RGMII_RXD2, RGMII_RXD3, RGMII_RXC, RGMII_RXCTL
ADC SPI: CS0, CS1, MISO, MOSI, SCLK
UART1: TXD, RXD
SD CARD: CMD, CLK, DAT0, DAT1, DAT2, DAT3, CD/SW
LCD BUS: SCL, SDA, LCD_R0, LCD_R1, LCD_R2, LCD_R3, LCD_R4, LCD_R5, LCD_R6, LCD_R7, LCD_G0, LCD_G1, LCD_G2, LCD_G3, LCD_G4, LCD_G5, LCD_G6, LCD_G7, LCD_B0, LCD_B1, LCD_B2, LCD_B3, LCD_B4, LCD_B5, LCD_B6, LCD_B7, LCD_RST, LCD_CLK, LCD_HSYNC, LCD_VSYNC, LCD_DE, LCD_BL, T_PEN, T_MISO, T_CS
Misc: PLED0, PLED1, PLED2, PLED3, BTN1, BTN0, GPIO0, GPIO1, GPIO2

### Nets
3V3: JTAG.2 R8.2 R9.2 ; port 3V3
5V: FPGA.J1_1(1) FPGA.J1_2(2) FPGA.J1_3(3) FPGA.J1_4(4) FPGA.J1_5(5) FPGA.J1_6(6) FPGA.J1_7(7) FPGA.J1_8(8) ; port 5V
GND: FPGA.J1_19(19) FPGA.J1_34(34) FPGA.J1_41(41) FPGA.J1_52(52) FPGA.J1_59(59) FPGA.J1_70(70) FPGA.J1_93(93) FPGA.J1_94(94) FPGA.J1_95(95) FPGA.J1_96(96) FPGA.J1_97(97) FPGA.J1_98(98) FPGA.J1_99(99) FPGA.J1_100(100) FPGA.J2_11(11) FPGA.J2_12(12) FPGA.J2_62(62) FPGA.J2_63(63) FPGA.J2_76(76) FPGA.J2_77(77) JTAG.1 JTAG.3 JTAG.5 JTAG.7 JTAG.9 JTAG.11 JTAG.13 SW1.1 SW1.2 ; port GND
AD_CLK: FPGA.J1_65(65) ; port ADC_SPI.SCLK
AD_CS0: FPGA.J1_66(66) ; port ADC_SPI.CS0
AD_CS1: FPGA.J1_68(68) ; port ADC_SPI.CS1
AD_MISO: FPGA.J1_63(63) ; port ADC_SPI.MISO
AD_MOSI: FPGA.J1_61(61) ; port ADC_SPI.MOSI
BOOT_MODE0: FPGA.J2_81(81) R10.2
BOOT_MODE1: FPGA.J2_79(79) R11.2
BTN0: FPGA.J2_57(57) ; port MISC.BTN0
BTN1: FPGA.J2_90(90) ; port MISC.BTN1
FPGA_TCK: FPGA.J2_99(99) R5.2
FPGA_TDI: FPGA.J2_98(98) R7.2
FPGA_TDO: FPGA.J2_97(97) R6.2
FPGA_TMS: FPGA.J2_100(100) R4.2
GPIO0: FPGA.J1_47(47) ; port MISC.GPIO0
GPIO1: FPGA.J1_49(49) ; port MISC.GPIO1
GPIO2: FPGA.J1_51(51) ; port MISC.GPIO2
HAD0: FPGA.J1_86(86) ; port Slot_x2.AD0
HAD1: FPGA.J1_84(84) ; port Slot_x2.AD1
HAD2: FPGA.J1_82(82) ; port Slot_x2.AD2
HAD3: FPGA.J1_80(80) ; port Slot_x2.AD3
HCLK: FPGA.J1_90(90) ; port Slot_x2.CLK
HCTR: FPGA.J1_74(74) ; port Slot_x2.CTR
HDIN: FPGA.J1_88(88) ; port Slot_x2.DIN
IIC_SCL: FPGA.J1_24(24) ; port LCD_BUS.SCL
IIC_SDA: FPGA.J1_14(14) ; port LCD_BUS.SDA
LAD0: FPGA.J1_73(73) ; port Slot_x8.AD0
LAD1: FPGA.J1_75(75) ; port Slot_x8.AD1
LAD2: FPGA.J1_77(77) ; port Slot_x8.AD2
LAD3: FPGA.J1_79(79) ; port Slot_x8.AD3
LAD4: FPGA.J1_81(81) ; port Slot_x8.AD4
LAD5: FPGA.J1_83(83) ; port Slot_x8.AD5
LCD_B0: FPGA.J1_27(27) ; port LCD_BUS.LCD_B0
LCD_B1: FPGA.J1_25(25) ; port LCD_BUS.LCD_B1
LCD_B2: FPGA.J1_28(28) ; port LCD_BUS.LCD_B2
LCD_B3: FPGA.J1_26(26) ; port LCD_BUS.LCD_B3
LCD_B4: FPGA.J1_23(23) ; port LCD_BUS.LCD_B4
LCD_B5: FPGA.J1_21(21) ; port LCD_BUS.LCD_B5
LCD_B6: FPGA.J1_22(22) ; port LCD_BUS.LCD_B6
LCD_B7: FPGA.J1_20(20) ; port LCD_BUS.LCD_B7
LCD_BL: FPGA.J2_29(29) ; port LCD_BUS.LCD_BL
LCD_CLK: FPGA.J1_18(18) ; port LCD_BUS.LCD_CLK
LCD_DE: FPGA.J1_11(11) ; port LCD_BUS.LCD_DE
LCD_G0: FPGA.J1_35(35) ; port LCD_BUS.LCD_G0
LCD_G1: FPGA.J1_33(33) ; port LCD_BUS.LCD_G1
LCD_G2: FPGA.J1_38(38) ; port LCD_BUS.LCD_G2
LCD_G3: FPGA.J1_36(36) ; port LCD_BUS.LCD_G3
LCD_G4: FPGA.J1_31(31) ; port LCD_BUS.LCD_G4
LCD_G5: FPGA.J1_29(29) ; port LCD_BUS.LCD_G5
LCD_G6: FPGA.J1_32(32) ; port LCD_BUS.LCD_G6
LCD_G7: FPGA.J1_30(30) ; port LCD_BUS.LCD_G7
LCD_HSYNC: FPGA.J1_16(16) ; port LCD_BUS.LCD_HSYNC
LCD_R0: FPGA.J1_45(45) ; port LCD_BUS.LCD_R0
LCD_R1: FPGA.J1_43(43) ; port LCD_BUS.LCD_R1
LCD_R2: FPGA.J1_46(46) ; port LCD_BUS.LCD_R2
LCD_R3: FPGA.J1_44(44) ; port LCD_BUS.LCD_R3
LCD_R4: FPGA.J1_39(39) ; port LCD_BUS.LCD_R4
LCD_R5: FPGA.J1_37(37) ; port LCD_BUS.LCD_R5
LCD_R6: FPGA.J1_42(42) ; port LCD_BUS.LCD_R6
LCD_R7: FPGA.J1_40(40) ; port LCD_BUS.LCD_R7
LCD_RST: FPGA.J2_50(50) ; port LCD_BUS.LCD_RST
LCD_VSYNC: FPGA.J1_13(13) ; port LCD_BUS.LCD_VSYNC
LCLK: FPGA.J1_69(69) ; port Slot_x8.CLK
LCTR: FPGA.J1_89(89) ; port Slot_x8.CTR
LDIN: FPGA.J1_71(71) ; port Slot_x8.DIN
PHY1_AD0: FPGA.J2_1(1) ; port PS_Ethernet.PHY_AD0
PHY1_AD1: FPGA.J2_2(2) ; port PS_Ethernet.PHY_AD1
PHY1_MDI0_N: FPGA.J2_5(5) ; port PS_Ethernet.PHY_MDI0_N
PHY1_MDI0_P: FPGA.J2_3(3) ; port PS_Ethernet.PHY_MDI0_P
PHY1_MDI1_N: FPGA.J2_9(9) ; port PS_Ethernet.PHY_MDI1_N
PHY1_MDI1_P: FPGA.J2_7(7) ; port PS_Ethernet.PHY_MDI1_P
PHY1_MDI2_N: FPGA.J2_6(6) ; port PS_Ethernet.PHY_MDI2_N
PHY1_MDI2_P: FPGA.J2_4(4) ; port PS_Ethernet.PHY_MDI2_P
PHY1_MDI3_N: FPGA.J2_10(10) ; port PS_Ethernet.PHY_MDI3_N
PHY1_MDI3_P: FPGA.J2_8(8) ; port PS_Ethernet.PHY_MDI3_P
PHY_MDC: FPGA.J2_16(16) ; port PHY_Config.PHY_MDC
PHY_MDIO: FPGA.J2_14(14) ; port PHY_Config.PHY_MDIO
PHY_RST_N: FPGA.J2_42(42) ; port PHY_Config.PHY_RST_N
PLED0: FPGA.J2_44(44) ; port MISC.PLED0
PLED1: FPGA.J2_55(55) ; port MISC.PLED1
PLED2: FPGA.J2_92(92) ; port MISC.PLED2
PLED3: FPGA.J2_95(95) ; port MISC.PLED3
RGMII_RXC: FPGA.J2_28(28) ; port PL_Ethernet.RGMII_RXC
RGMII_RXCTL: FPGA.J2_32(32) ; port PL_Ethernet.RGMII_RXCTL
RGMII_RXD0: FPGA.J2_40(40) ; port PL_Ethernet.RGMII_RXD0
RGMII_RXD1: FPGA.J2_38(38) ; port PL_Ethernet.RGMII_RXD1
RGMII_RXD2: FPGA.J2_36(36) ; port PL_Ethernet.RGMII_RXD2
RGMII_RXD3: FPGA.J2_34(34) ; port PL_Ethernet.RGMII_RXD3
RGMII_TXC: FPGA.J2_24(24) ; port PL_Ethernet.RGMII_TXC
RGMII_TXCTL: FPGA.J2_26(26) ; port PL_Ethernet.RGMII_TXCTL
RGMII_TXD0: FPGA.J2_30(30) ; port PL_Ethernet.RGMII_TXD0
RGMII_TXD1: FPGA.J2_22(22) ; port PL_Ethernet.RGMII_TXD1
RGMII_TXD2: FPGA.J2_20(20) ; port PL_Ethernet.RGMII_TXD2
RGMII_TXD3: FPGA.J2_18(18) ; port PL_Ethernet.RGMII_TXD3
SD_CD: FPGA.J2_91(91) ; port SD Card.CD/SW
SD_CLK: FPGA.J2_80(80) ; port SD Card.CLK
SD_CMD: FPGA.J2_78(78) ; port SD Card.CMD
SD_D0: FPGA.J2_82(82) ; port SD Card.DAT0
SD_D1: FPGA.J2_84(84) ; port SD Card.DAT1
SD_D2: FPGA.J2_86(86) ; port SD Card.DAT2
SD_D3: FPGA.J2_88(88) ; port SD Card.DAT3
T_CS: FPGA.J2_31(31) ; port LCD_BUS.T_CS
T_MISO: FPGA.J1_12(12) ; port LCD_BUS.T_MISO
T_PEN: FPGA.J1_17(17) ; port LCD_BUS.T_PEN
UART1_RXD: FPGA.J2_89(89) ; port UART1.RXD
UART1_TXD: FPGA.J2_87(87) ; port UART1.TXD
NetJTAG_4: JTAG.4 R4.1
NetJTAG_6: JTAG.6 R5.1
NetJTAG_8: JTAG.8 R6.1
NetJTAG_10: JTAG.10 R7.1
NetR8_1: R8.1 R10.1 SW1.4
NetR9_1: R9.1 R11.1 SW1.3

Not connected (* = marked no-connect by the designer): FPGA J1_9(9) J1_10(10) J1_15(15)* J1_48(48)* J1_50(50)* J1_53(53)* J1_54(54)* J1_55(55)* J1_56(56)* J1_57(57)* J1_58(58)* J1_60(60)* J1_62(62)* J1_64(64)* J1_67(67)* J1_72(72)* J1_76(76)* J1_78(78)* J1_85(85)* J1_87(87)* J1_91(91) J1_92(92) J2_13(13)* J2_15(15)* J2_17(17)* J2_19(19)* J2_21(21)* J2_23(23)* J2_25(25)* J2_27(27)* J2_33(33)* J2_35(35)* J2_37(37)* J2_39(39)* J2_41(41)* J2_43(43)* J2_45(45)* J2_46(46)* J2_47(47)* J2_48(48)* J2_49(49)* J2_51(51)* J2_52(52)* J2_53(53)* J2_54(54)* J2_56(56)* J2_58(58)* J2_59(59)* J2_60(60)* J2_61(61)* J2_64(64)* J2_65(65)* J2_66(66)* J2_67(67)* J2_68(68)* J2_69(69)* J2_70(70)* J2_71(71)* J2_72(72)* J2_73(73)* J2_74(74)* J2_75(75)* J2_83(83)* J2_85(85)* J2_93(93)* J2_94(94)* J2_96(96)*; JTAG 12* 14*

### Layout directives
differential pair: PHY1_MDI0_N, PHY1_MDI0_P, PHY1_MDI1_N, PHY1_MDI1_P, PHY1_MDI2_N, PHY1_MDI2_P, PHY1_MDI3_N, PHY1_MDI3_P

### Notes on the sheet
- Title
- FileName:
- Version:
- Date:
- Project
- Designed By:
- Descriptions:
- Sheet:
- of
- (in symbol SW-2P) NO

### Library data of the parts
FPGA = ZYNQ7010&7020: ZYNQ7010&7020 Core Board
JTAG = Header 7X2: 7*2P接插件; 版权归属: 封装库来自淘宝 ID：黄晶宝石; BOM名称: 7*2P接插件; 学习资源: https://shop463601444.taobao.com
R4-R11 = R: as R1 on sheet 24V_Supply; BOM名称: 贴片电阻; 联系售后: https://shop463601444.taobao.com
SW1 = SW-2P: 2路编码开关 / *LCID: C976324; 淘宝ID: 黄晶宝石; BOM名称: 2路编码开关; 学习资源: https://shop463601444.taobao.com

## Sheet Ethernet.SchDoc: Dual Giga-Ethernet Interfaces (PL & PS)
size A4; DocumentNumber: 9; SheetNumber: 9; SheetTotal: 16
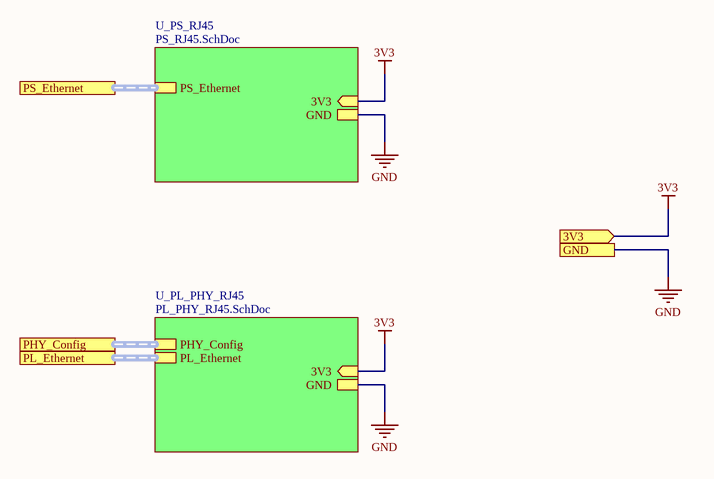
[diagram p8: Ethernet.SchDoc]

### Sub-sheets
U_PL_PHY_RJ45 = PL_PHY_RJ45.SchDoc: PL_Ethernet (harness PL Ethernet), PHY_Config (harness PHY Config), GND, 3V3 (in)
U_PS_RJ45 = PS_RJ45.SchDoc: PS_Ethernet (harness PS Ethernet), GND, 3V3 (in)

### Ports
3V3 (in), GND, PHY_Config, PL_Ethernet, PS_Ethernet

### Nets
3V3: port 3V3, sheet U_PS_RJ45/3V3, sheet U_PL_PHY_RJ45/3V3
GND: port GND, sheet U_PS_RJ45/GND, sheet U_PL_PHY_RJ45/GND

### Buses and harness runs
harness port PHY_Config = sheet U_PL_PHY_RJ45/PHY_Config
harness port PL_Ethernet = sheet U_PL_PHY_RJ45/PL_Ethernet
harness port PS_Ethernet = sheet U_PS_RJ45/PS_Ethernet

### Notes on the sheet
- Title
- FileName:
- Version:
- Date:
- Project
- Designed By:
- Descriptions:
- Sheet:
- of

## Sheet PS_RJ45.SchDoc: Ethernet From Processing System (PS) to RJ45 Interface
size A4; DocumentNumber: 10; SheetNumber: 10; SheetTotal: 16
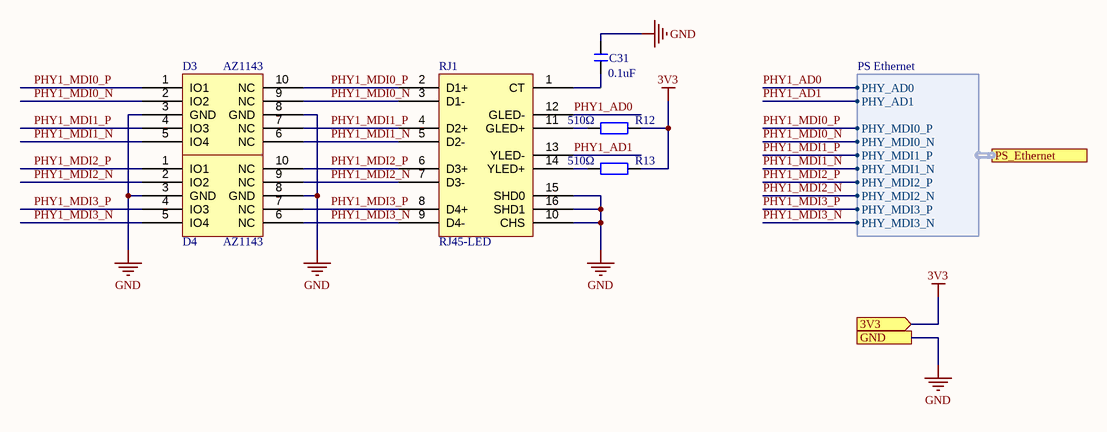
[diagram p9: PS_RJ45.SchDoc]

### Parts
C31  0.1uF  [C 0603_L]
D3  AZ1143  [DFN-10_L2.5-W1.0-P0.50-BL-A]
D4  AZ1143  [DFN-10_L2.5-W1.0-P0.50-BL-A]
R12  510Ω  [R 0603_L]
R13  510Ω  [R 0603_L]
RJ1  RJ45-LED  [RJ-45A16]

### Ports
3V3 (in), GND, PS_Ethernet (harness PS Ethernet)

### Harnesses
PS Ethernet: PHY_AD0, PHY_AD1, PHY_MDI0_P, PHY_MDI0_N, PHY_MDI1_P, PHY_MDI1_N, PHY_MDI2_P, PHY_MDI2_N, PHY_MDI3_P, PHY_MDI3_N

### Nets
3V3: R12.2 R13.2 ; port 3V3
GND: C31.2 D3.3(GND) D3.8(GND) D4.3(GND) D4.8(GND) RJ1.10(CHS) RJ1.15(SHD0) RJ1.16(SHD1) ; port GND
PHY1_AD0: RJ1.12(GLED-) ; port PS_Ethernet.PHY_AD0
PHY1_AD1: RJ1.13(YLED-) ; port PS_Ethernet.PHY_AD1
PHY1_MDI0_N: D3.2(IO2) D3.9(NC) RJ1.3(D1-) ; port PS_Ethernet.PHY_MDI0_N
PHY1_MDI0_P: D3.1(IO1) D3.10(NC) RJ1.2(D1+) ; port PS_Ethernet.PHY_MDI0_P
PHY1_MDI1_N: D3.5(IO4) D3.6(NC) RJ1.5(D2-) ; port PS_Ethernet.PHY_MDI1_N
PHY1_MDI1_P: D3.4(IO3) D3.7(NC) RJ1.4(D2+) ; port PS_Ethernet.PHY_MDI1_P
PHY1_MDI2_N: D4.2(IO2) D4.9(NC) RJ1.7(D3-) ; port PS_Ethernet.PHY_MDI2_N
PHY1_MDI2_P: D4.1(IO1) D4.10(NC) RJ1.6(D3+) ; port PS_Ethernet.PHY_MDI2_P
PHY1_MDI3_N: D4.5(IO4) D4.6(NC) RJ1.9(D4-) ; port PS_Ethernet.PHY_MDI3_N
PHY1_MDI3_P: D4.4(IO3) D4.7(NC) RJ1.8(D4+) ; port PS_Ethernet.PHY_MDI3_P
NetC31_1: C31.1 RJ1.1(CT)
NetR12_1: R12.1 RJ1.11(GLED+)
NetR13_1: R13.1 RJ1.14(YLED+)

### Notes on the sheet
- Title
- FileName:
- Version:
- Date:
- Project
- Designed By:
- Descriptions:
- Sheet:
- of

### Library data of the parts
C31 = C: as C1 on sheet 24V_Supply; 联系售后，技术支持: https://shop463601444.taobao.com; 唯一出售店铺网址: https://shop463601444.taobao.com
D3 D4 = AZ1143: Transient Voltage Suppression (TVS) Diode
R12 R13 = R: as R1 on sheet 24V_Supply; BOM名称: 贴片电阻; 联系售后: https://shop463601444.taobao.com
RJ1 = RJ45-2LED: 带灯以太网接口; 版权归属: 封装库来自淘宝 ID：黄晶宝石; BOM名称: 带灯以太网接口; 学习资源: https://shop463601444.taobao.com

## Sheet PL_PHY_RJ45.SchDoc: Ethernet From Programmable Logic (PL) to PHY and RJ45
size A4; DocumentNumber: 11; SheetNumber: 11; SheetTotal: 16
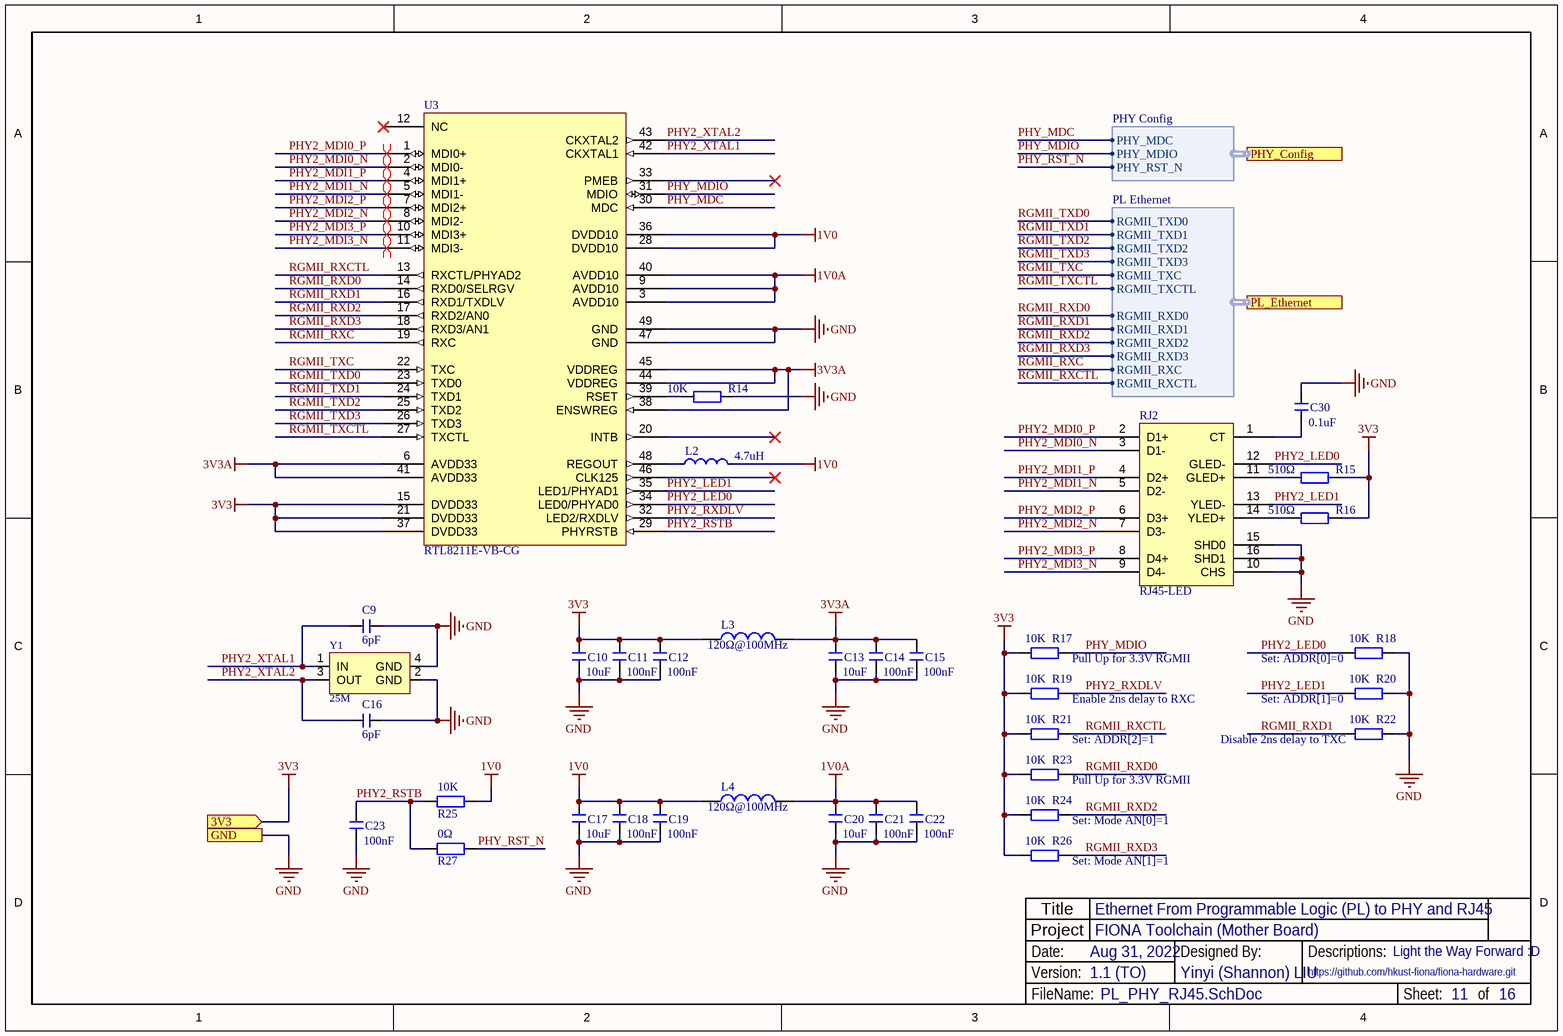
[diagram p10: PL_PHY_RJ45.SchDoc]

### Parts
C9  6pF  [C 0402_L]
C10  10uF  [C 0402_L]
C11  100nF  [C 0402_L]
C12  100nF  [C 0402_L]
C13  10uF  [C 0402_L]
C14  100nF  [C 0402_L]
C15  100nF  [C 0402_L]
C16  6pF  [C 0402_L]
C17  10uF  [C 0402_L]
C18  100nF  [C 0402_L]
C19  100nF  [C 0402_L]
C20  10uF  [C 0402_L]
C21  100nF  [C 0402_L]
C22  100nF  [C 0402_L]
C23  100nF  [C 0201_L]
C30  0.1uF  [C 0603_L]
L2  Inductance: 4.7uH  [IND-SMD_L7.6-W6.6]  (hidden comment: Inductance SMD)
L3  120Ω@100MHz  [L 0603]
L4  120Ω@100MHz  [L 0603]
R14  10K  [R 0402_L]
R15  510Ω  [R 0402_L]
R16  510Ω  [R 0402_L]
R17  10K  [R 0201_L]
R18  10K  [R 0201_L]
R19  10K  [R 0201_L]
R20  10K  [R 0201_L]
R21  10K  [R 0201_L]
R22  10K  [R 0201_L]
R23  10K  [R 0201_L]
R24  10K  [R 0201_L]
R25  10K  [R 0201_L]
R26  10K  [R 0201_L]
R27  0Ω  [R 0201_L]
RJ2  RJ45-LED  [RJ-45A16]
U3  RTL8211E-VB-CG  [QFN-48_L6.0-W6.0-P0.40]
Y1  25M  [XTAL-3225]

### Ports
3V3 (in), GND, PHY_Config (harness PHY Config), PL_Ethernet (harness PL Ethernet)

### Harnesses
PL Ethernet: RGMII_TXD0, RGMII_TXD1, RGMII_TXD2, RGMII_TXD3, RGMII_TXC, RGMII_TXCTL, RGMII_RXD0, RGMII_RXD1, RGMII_RXD2, RGMII_RXD3, RGMII_RXC, RGMII_RXCTL
PHY Config: PHY_MDC, PHY_MDIO, PHY_RST_N

### Nets
1V0: C17.2 C18.2 C19.2 L2.2 L4.1 R25.2 U3.28(DVDD10) U3.36(DVDD10)
1V0A: C20.2 C21.2 C22.2 L4.2 U3.3(AVDD10) U3.9(AVDD10) U3.40(AVDD10)
3V3: C10.2 C11.2 C12.2 L3.1 R15.2 R16.2 R17.1 R19.1 R21.1 R23.1 R24.1 R26.1 U3.15(DVDD33) U3.21(DVDD33) U3.37(DVDD33) ; port 3V3
3V3A: C13.2 C14.2 C15.2 L3.2 U3.6(AVDD33) U3.38(ENSWREG) U3.41(AVDD33) U3.44(VDDREG) U3.45(VDDREG)
GND: C9.2 C10.1 C11.1 C12.1 C13.1 C14.1 C15.1 C16.2 C17.1 C18.1 C19.1 C20.1 C21.1 C22.1 C23.1 C30.2 R14.2 R18.2 R20.2 R22.2 RJ2.10(CHS) RJ2.15(SHD0) RJ2.16(SHD1) U3.47(GND) U3.49(GND) Y1.2(GND) Y1.4(GND) ; port GND
PHY2_LED0: R18.1 RJ2.12(GLED-) U3.34(LED0/PHYAD0)
PHY2_LED1: R20.1 RJ2.13(YLED-) U3.35(LED1/PHYAD1)
PHY2_MDI0_N: RJ2.3(D1-) U3.2(MDI0-)
PHY2_MDI0_P: RJ2.2(D1+) U3.1(MDI0+)
PHY2_MDI1_N: RJ2.5(D2-) U3.5(MDI1-)
PHY2_MDI1_P: RJ2.4(D2+) U3.4(MDI1+)
PHY2_MDI2_N: RJ2.7(D3-) U3.8(MDI2-)
PHY2_MDI2_P: RJ2.6(D3+) U3.7(MDI2+)
PHY2_MDI3_N: RJ2.9(D4-) U3.11(MDI3-)
PHY2_MDI3_P: RJ2.8(D4+) U3.10(MDI3+)
PHY2_RSTB: C23.2 R25.1 R27.1 U3.29(PHYRSTB)
PHY2_RXDLV: R19.2 U3.32(LED2/RXDLV)
PHY2_XTAL1: C9.1 U3.42(CKXTAL1) Y1.1(IN)
PHY2_XTAL2: C16.1 U3.43(CKXTAL2) Y1.3(OUT)
PHY_MDC: U3.30(MDC) ; port PHY_Config.PHY_MDC
PHY_MDIO: R17.2 U3.31(MDIO) ; port PHY_Config.PHY_MDIO
PHY_RST_N: R27.2 ; port PHY_Config.PHY_RST_N
RGMII_RXC: U3.19(RXC) ; port PL_Ethernet.RGMII_RXC
RGMII_RXCTL: R21.2 U3.13(RXCTL/PHYAD2) ; port PL_Ethernet.RGMII_RXCTL
RGMII_RXD0: R23.2 U3.14(RXD0/SELRGV) ; port PL_Ethernet.RGMII_RXD0
RGMII_RXD1: R22.1 U3.16(RXD1/TXDLV) ; port PL_Ethernet.RGMII_RXD1
RGMII_RXD2: R24.2 U3.17(RXD2/AN0) ; port PL_Ethernet.RGMII_RXD2
RGMII_RXD3: R26.2 U3.18(RXD3/AN1) ; port PL_Ethernet.RGMII_RXD3
RGMII_TXC: U3.22(TXC) ; port PL_Ethernet.RGMII_TXC
RGMII_TXCTL: U3.27(TXCTL) ; port PL_Ethernet.RGMII_TXCTL
RGMII_TXD0: U3.23(TXD0) ; port PL_Ethernet.RGMII_TXD0
RGMII_TXD1: U3.24(TXD1) ; port PL_Ethernet.RGMII_TXD1
RGMII_TXD2: U3.25(TXD2) ; port PL_Ethernet.RGMII_TXD2
RGMII_TXD3: U3.26(TXD3) ; port PL_Ethernet.RGMII_TXD3
NetC30_1: C30.1 RJ2.1(CT)
NetL2_1: L2.1 U3.48(REGOUT)
NetR14_1: R14.1 U3.39(RSET)
NetR15_1: R15.1 RJ2.11(GLED+)
NetR16_1: R16.1 RJ2.14(YLED+)

Not connected (* = marked no-connect by the designer): U3 12(NC)* 20(INTB)* 33(PMEB)* 46(CLK125)*

### Layout directives
differential pair: PHY2_MDI0_N, PHY2_MDI0_P, PHY2_MDI1_N, PHY2_MDI1_P, PHY2_MDI2_N, PHY2_MDI2_P, PHY2_MDI3_N, PHY2_MDI3_P

### Notes on the sheet
- (near R17) Pull Up for 3.3V RGMII
- (near R19) Enable 2ns delay to RXC
- (near R18) Set: ADDR[0]=0
- (near R20) Set: ADDR[1]=0
- (near R21) Set: ADDR[2]=1
- (near R23) Pull Up for 3.3V RGMII
- (near R22) Disable 2ns delay to TXC
- (near R24) Set: Mode AN[0]=1
- (near R26) Set: Mode AN[1]=1
- Title
- FileName:
- Version:
- Date:
- Project
- Designed By:
- Descriptions:
- Sheet:
- of

### Library data of the parts
C9-C23 C30 = C: as C1 on sheet 24V_Supply; 联系售后，技术支持: https://shop463601444.taobao.com; 唯一出售店铺网址: https://shop463601444.taobao.com
L2 = Inductance SMD: *LCID: C967698
L3 L4 = L: 小功率贴片电感; 淘宝ID: 封装库来自淘宝 ID：黄晶宝石; 封装库来自淘宝卖家 ID：黄晶宝石: 其他店铺购入均为盗版，不享受售后技术支持服务，请立即申请退款; BOM名称: 小功率贴片电感; 联系售后: https://shop463601444.taobao.com
R14-R27 = R: as R1 on sheet 24V_Supply; BOM名称: 贴片电阻; 联系售后: https://shop463601444.taobao.com
RJ2 = RJ45-2LED: 带灯以太网接口; 版权归属: 封装库来自淘宝 ID：黄晶宝石; BOM名称: 带灯以太网接口; 学习资源: https://shop463601444.taobao.com
U3 = RTL8211E-VB-CG: Ethernet RGMII PHY Chip / *LCID: C90735
Y1 = XTAL-4P: 4脚无源晶振; BOM名称: 4脚晶振; 版权归属: 源创客; 学习资源: www.ooocke.com

## Sheet ADC_Array.SchDoc: 16-Channel 12-bit 4.096V ADC Array with SMA Interfaces
size A4; DocumentNumber: 12; SheetNumber: 12; SheetTotal: 16
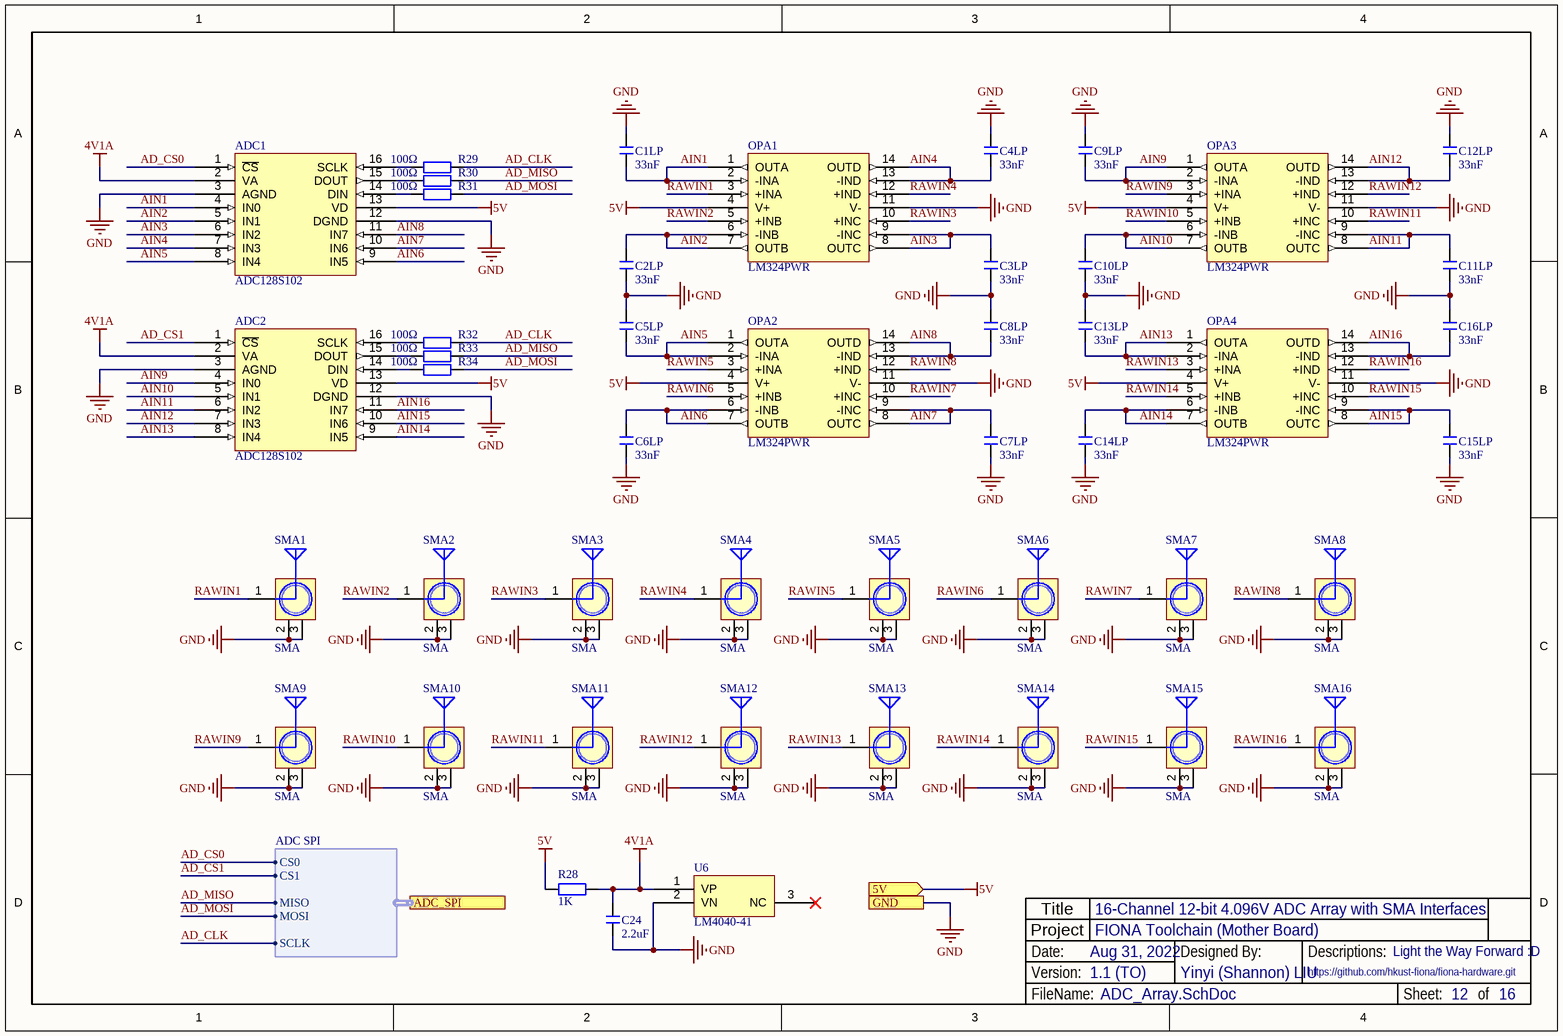
[diagram p11: ADC_Array.SchDoc]

### Parts
ADC1  ADC128S102  [TSSOP16_N]
ADC2  ADC128S102  [TSSOP16_N]
C1LP  33nF  [C 0402_L]
C2LP  33nF  [C 0402_L]
C3LP  33nF  [C 0402_L]
C4LP  33nF  [C 0402_L]
C5LP  33nF  [C 0402_L]
C6LP  33nF  [C 0402_L]
C7LP  33nF  [C 0402_L]
C8LP  33nF  [C 0402_L]
C9LP  33nF  [C 0402_L]
C10LP  33nF  [C 0402_L]
C11LP  33nF  [C 0402_L]
C12LP  33nF  [C 0402_L]
C13LP  33nF  [C 0402_L]
C14LP  33nF  [C 0402_L]
C15LP  33nF  [C 0402_L]
C16LP  33nF  [C 0402_L]
C24  2.2uF  [C 0805_L]
OPA1  LM324PWR  [TSSOP-14]
OPA2  LM324PWR  [TSSOP-14]
OPA3  LM324PWR  [TSSOP-14]
OPA4  LM324PWR  [TSSOP-14]
R28  1K  [R 0805_L]
R29  100Ω  [R 0603_L]
R30  100Ω  [R 0603_L]
R31  100Ω  [R 0603_L]
R32  100Ω  [R 0603_L]
R33  100Ω  [R 0603_L]
R34  100Ω  [R 0603_L]
SMA1  SMA  [SMA_FR]
SMA2  SMA  [SMA_FR]
SMA3  SMA  [SMA_FR]
SMA4  SMA  [SMA_FR]
SMA5  SMA  [SMA_FR]
SMA6  SMA  [SMA_FR]
SMA7  SMA  [SMA_FR]
SMA8  SMA  [SMA_FR]
SMA9  SMA  [SMA_FR]
SMA10  SMA  [SMA_FR]
SMA11  SMA  [SMA_FR]
SMA12  SMA  [SMA_FR]
SMA13  SMA  [SMA_FR]
SMA14  SMA  [SMA_FR]
SMA15  SMA  [SMA_FR]
SMA16  SMA  [SMA_FR]
U6  LM4040-41  [SOT23-3]

### Ports
5V (in), ADC_SPI (harness ADC SPI), GND

### Harnesses
ADC SPI: CS0, CS1, MISO, MOSI, SCLK

### Nets
4V1A: ADC1.2(VA) ADC2.2(VA) C24.1 R28.2 U6.1(VP)
5V: ADC1.13(VD) ADC2.13(VD) OPA1.4(V+) OPA2.4(V+) OPA3.4(V+) OPA4.4(V+) R28.1 ; port 5V
GND: ADC1.3(AGND) ADC1.12(DGND) ADC2.3(AGND) ADC2.12(DGND) C1LP.2 C2LP.1 C3LP.1 C4LP.2 C5LP.2 C6LP.1 C7LP.1 C8LP.2 C9LP.2 C10LP.1 C11LP.1 C12LP.2 C13LP.2 C14LP.1 C15LP.1 C16LP.2 C24.2 OPA1.11(V-) OPA2.11(V-) OPA3.11(V-) OPA4.11(V-) SMA1.2(GND) SMA1.3(GND) SMA2.2(GND) SMA2.3(GND) SMA3.2(GND) SMA3.3(GND) SMA4.2(GND) SMA4.3(GND) SMA5.2(GND) SMA5.3(GND) SMA6.2(GND) SMA6.3(GND) SMA7.2(GND) SMA7.3(GND) SMA8.2(GND) SMA8.3(GND) SMA9.2(GND) SMA9.3(GND) SMA10.2(GND) SMA10.3(GND) SMA11.2(GND) SMA11.3(GND) SMA12.2(GND) SMA12.3(GND) SMA13.2(GND) SMA13.3(GND) SMA14.2(GND) SMA14.3(GND) SMA15.2(GND) SMA15.3(GND) SMA16.2(GND) SMA16.3(GND) U6.2(VN) ; port GND
AD_CLK: R29.2 R32.2 ; port ADC_SPI.SCLK
AD_CS0: ADC1.1(~{CS}) ; port ADC_SPI.CS0
AD_CS1: ADC2.1(~{CS}) ; port ADC_SPI.CS1
AD_MISO: R30.2 R33.2 ; port ADC_SPI.MISO
AD_MOSI: R31.2 R34.2 ; port ADC_SPI.MOSI
AIN1: ADC1.4(IN0) C1LP.1 OPA1.1(OUTA) OPA1.2(-INA)
AIN2: ADC1.5(IN1) C2LP.2 OPA1.6(-INB) OPA1.7(OUTB)
AIN3: ADC1.6(IN2) C3LP.2 OPA1.8(OUTC) OPA1.9(-INC)
AIN4: ADC1.7(IN3) C4LP.1 OPA1.13(-IND) OPA1.14(OUTD)
AIN5: ADC1.8(IN4) C5LP.1 OPA2.1(OUTA) OPA2.2(-INA)
AIN6: ADC1.9(IN5) C6LP.2 OPA2.6(-INB) OPA2.7(OUTB)
AIN7: ADC1.10(IN6) C7LP.2 OPA2.8(OUTC) OPA2.9(-INC)
AIN8: ADC1.11(IN7) C8LP.1 OPA2.13(-IND) OPA2.14(OUTD)
AIN9: ADC2.4(IN0) C9LP.1 OPA3.1(OUTA) OPA3.2(-INA)
AIN10: ADC2.5(IN1) C10LP.2 OPA3.6(-INB) OPA3.7(OUTB)
AIN11: ADC2.6(IN2) C11LP.2 OPA3.8(OUTC) OPA3.9(-INC)
AIN12: ADC2.7(IN3) C12LP.1 OPA3.13(-IND) OPA3.14(OUTD)
AIN13: ADC2.8(IN4) C13LP.1 OPA4.1(OUTA) OPA4.2(-INA)
AIN14: ADC2.9(IN5) C14LP.2 OPA4.6(-INB) OPA4.7(OUTB)
AIN15: ADC2.10(IN6) C15LP.2 OPA4.8(OUTC) OPA4.9(-INC)
AIN16: ADC2.11(IN7) C16LP.1 OPA4.13(-IND) OPA4.14(OUTD)
RAWIN1: OPA1.3(+INA) SMA1.1(ANT)
RAWIN2: OPA1.5(+INB) SMA2.1(ANT)
RAWIN3: OPA1.10(+INC) SMA3.1(ANT)
RAWIN4: OPA1.12(+IND) SMA4.1(ANT)
RAWIN5: OPA2.3(+INA) SMA5.1(ANT)
RAWIN6: OPA2.5(+INB) SMA6.1(ANT)
RAWIN7: OPA2.10(+INC) SMA7.1(ANT)
RAWIN8: OPA2.12(+IND) SMA8.1(ANT)
RAWIN9: OPA3.3(+INA) SMA9.1(ANT)
RAWIN10: OPA3.5(+INB) SMA10.1(ANT)
RAWIN11: OPA3.10(+INC) SMA11.1(ANT)
RAWIN12: OPA3.12(+IND) SMA12.1(ANT)
RAWIN13: OPA4.3(+INA) SMA13.1(ANT)
RAWIN14: OPA4.5(+INB) SMA14.1(ANT)
RAWIN15: OPA4.10(+INC) SMA15.1(ANT)
RAWIN16: OPA4.12(+IND) SMA16.1(ANT)
NetADC1_14: ADC1.14(DIN) R31.1
NetADC1_15: ADC1.15(DOUT) R30.1
NetADC1_16: ADC1.16(SCLK) R29.1
NetADC2_14: ADC2.14(DIN) R34.1
NetADC2_15: ADC2.15(DOUT) R33.1
NetADC2_16: ADC2.16(SCLK) R32.1

Not connected (* = marked no-connect by the designer): U6 3(NC)*

### Notes on the sheet
- Title
- FileName:
- Version:
- Date:
- Project
- Designed By:
- Descriptions:
- Sheet:
- of

### Library data of the parts
ADC1 ADC2 = ADC128S102: TI 12-bit Oct-channel ADC / C179666
C1LP C2LP C3LP C4LP C5LP C6LP C7LP C8LP C9LP C10LP C11LP C12LP C13LP C14LP C15LP C16LP C24 = C: as C1 on sheet 24V_Supply; 联系售后，技术支持: https://shop463601444.taobao.com; 唯一出售店铺网址: https://shop463601444.taobao.com
OPA1-OPA4 = OPA4197IPWR: Quad-channel Operational Amplifier
R28 = R: 贴片电阻 / *LCID: C2907295; 版权归属: 来自淘宝 ID：黄晶宝石; 封装库来自淘宝卖家 ID：黄晶宝石: 其他店铺购入均为盗版，不享受售后技术支持服务，请立即申请退款; BOM名称: 贴片电阻; 联系售后: https://shop463601444.taobao.com
R29-R34 = R: as R1 on sheet 24V_Supply; BOM名称: 贴片电阻; 联系售后: https://shop463601444.taobao.com
SMA1-SMA16 = SMA: SMA-2.4G射频天线接口; 版权归属: 封装库来自淘宝 ID：黄晶宝石; BOM名称: SMA-2.4G射频天线接口; 学习资源: https://shop463601444.taobao.com
U6 = LM4040: Shunt Voltage Reference 4.096V

## Sheet UART_TypeC.SchDoc: UART with Type-C USB Interface
size A4; DocumentNumber: 13; SheetNumber: 13; SheetTotal: 16
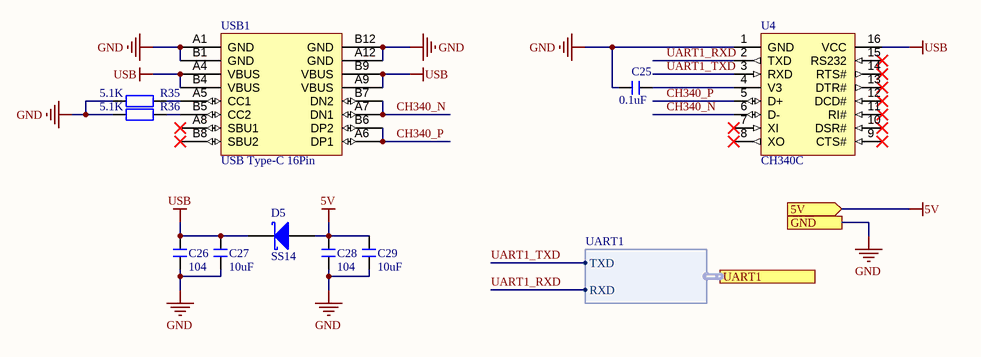
[diagram p12: UART_TypeC.SchDoc]

### Parts
C25  0.1uF  [C 0603_L]
C26  104  [C 0603_L]
C27  10uF  [C 0603_L]
C28  104  [C 0603_L]
C29  10uF  [C 0603_L]
D5  SS14  [SMA]
R35  5.1K  [R 0603_L]
R36  5.1K  [R 0603_L]
U4  CH340C  [SOP16_L]
USB1  USB Type-C 16Pin  [USB-C-SMD-TAILOR]

### Ports
5V (in), GND, UART1 (harness UART1)

### Harnesses
UART1: TXD, RXD

### Nets
5V: C28.2 C29.2 D5.1(A) ; port 5V
GND: C25.1 C26.1 C27.1 C28.1 C29.1 R35.1 R36.1 U4.1(GND) USB1.A1(GND) USB1.A12(GND) USB1.B1(GND) USB1.B12(GND) ; port GND
USB: C26.2 C27.2 D5.2(K) U4.16(VCC) USB1.A4(VBUS) USB1.A9(VBUS) USB1.B4(VBUS) USB1.B9(VBUS)
CH340_N: U4.6(D-) USB1.A7(DN1) USB1.B7(DN2)
CH340_P: U4.5(D+) USB1.A6(DP1) USB1.B6(DP2)
UART1_RXD: U4.2(TXD) ; port UART1.RXD
UART1_TXD: U4.3(RXD) ; port UART1.TXD
NetC25_2: C25.2 U4.4(V3)
NetR35_2: R35.2 USB1.A5(CC1)
NetR36_2: R36.2 USB1.B5(CC2)

Not connected (* = marked no-connect by the designer): U4 7(XI)* 8(XO)* 9(CTS#)* 10(DSR#)* 11(RI#)* 12(DCD#)* 13(DTR#)* 14(RTS#)* 15(RS232)*; USB1 A8(SBU1)* B8(SBU2)*

### Notes on the sheet
- Title
- FileName:
- Version:
- Date:
- Project
- Designed By:
- Descriptions:
- Sheet:
- of

### Library data of the parts
C25-C29 = C: as C1 on sheet 24V_Supply; 联系售后，技术支持: https://shop463601444.taobao.com; 唯一出售店铺网址: https://shop463601444.taobao.com
D5 = SS14: 肖特基二极管; 属性: 40V/1A; BOM名称: 肖特基二极管; 封装库来自淘宝 ID：黄晶宝石: https://shop463601444.taobao.com
R35 R36 = R: as R1 on sheet 24V_Supply; BOM名称: 贴片电阻; 联系售后: https://shop463601444.taobao.com
U4 = CH340G: 串口转USB; 版权归属: 封装库来自淘宝 ID：黄晶宝石; BOM名称: 串口转USB; 学习资源: https://shop463601444.taobao.com

## Sheet SD_Card.SchDoc: 2-Way SD Card for Loading Operating System
size A4; DocumentNumber: 15; SheetNumber: 15; SheetTotal: 16
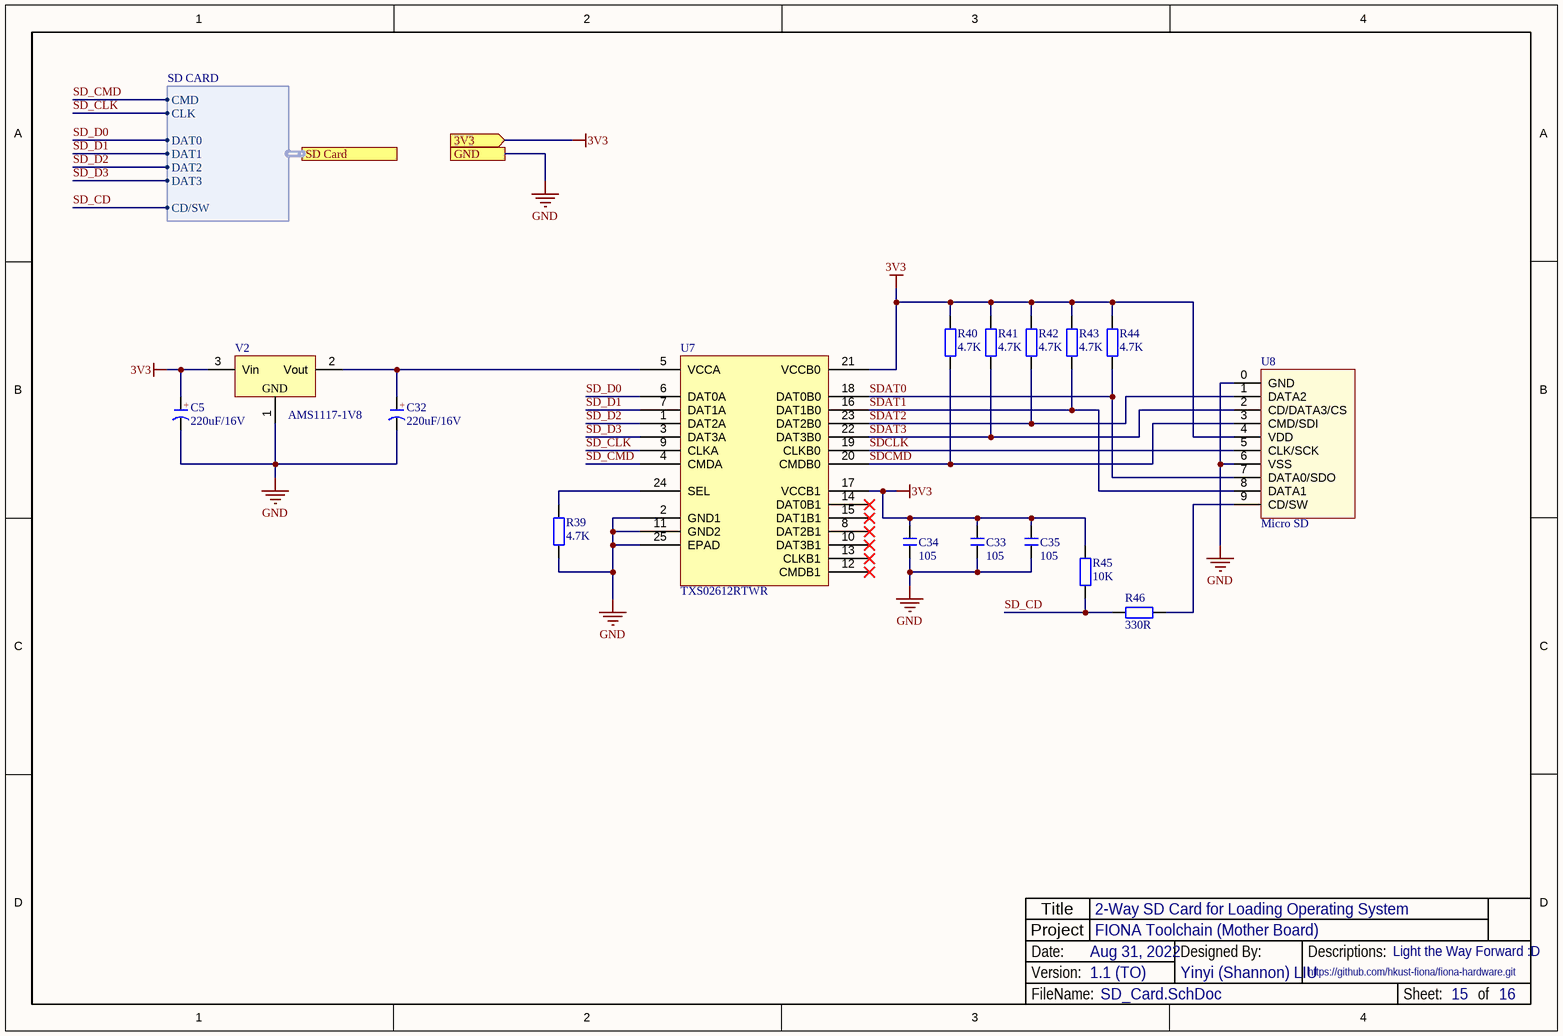
[diagram p13: SD_Card.SchDoc]

### Parts
C5  220uF/16V  [CM D(6.3*7.7)]
C32  220uF/16V  [CM D(6.3*7.7)]
C33  105  [C 0603_L]
C34  105  [C 0603_L]
C35  105  [C 0603_L]
R39  4.7K  [R 0201_L]
R40  4.7K  [R 0201_L]
R41  4.7K  [R 0201_L]
R42  4.7K  [R 0201_L]
R43  4.7K  [R 0201_L]
R44  4.7K  [R 0201_L]
R45  10K  [R 0201_L]
R46  330R  [R 0201_L]
U7  TXS02612RTWR  [QFN24_RTW]
U8  Micro SD  [Micro SD]
V2  AMS1117-1V8  [SOT223_L]

### Ports
3V3 (in), GND, SD Card (harness SD CARD)

### Harnesses
SD CARD: CMD, CLK, DAT0, DAT1, DAT2, DAT3, CD/SW

### Nets
3V3: C5.1(A) C33.2 C34.2 C35.2 R40.2 R41.2 R42.2 R43.2 R44.2 R45.2 U7.17(VCCB1) U7.21(VCCB0) U8.4(VDD) V2.3(Vin) ; port 3V3
GND: C5.2(K) C32.2(K) C33.1 C34.1 C35.1 R39.1 U7.2(GND1) U7.11(GND2) U7.25(EPAD) U8.0(GND) U8.6(VSS) V2.1(GND) ; port GND
SD_CD: R45.1 R46.2 ; port SD Card.CD/SW
SD_CLK: U7.9(CLKA) ; port SD Card.CLK
SD_CMD: U7.4(CMDA) ; port SD Card.CMD
SD_D0: U7.6(DAT0A) ; port SD Card.DAT0
SD_D1: U7.7(DAT1A) ; port SD Card.DAT1
SD_D2: U7.1(DAT2A) ; port SD Card.DAT2
SD_D3: U7.3(DAT3A) ; port SD Card.DAT3
SDAT0: R44.1 U7.18(DAT0B0) U8.7(DATA0/SDO)
SDAT1: R43.1 U7.16(DAT1B0) U8.8(DATA1)
SDAT2: R42.1 U7.23(DAT2B0) U8.1(DATA2)
SDAT3: R41.1 U7.22(DAT3B0) U8.2(CD/DATA3/CS)
SDCLK: U7.19(CLKB0) U8.5(CLK/SCK)
SDCMD: R40.1 U7.20(CMDB0) U8.3(CMD/SDI)
NetC32_1: C32.1(A) U7.5(VCCA) V2.2(Vout)
NetR39_2: R39.2 U7.24(SEL)
NetR46_1: R46.1 U8.9(CD/SW)

Not connected (* = marked no-connect by the designer): U7 8(DAT2B1)* 10(DAT3B1)* 12(CMDB1)* 13(CLKB1)* 14(DAT0B1)* 15(DAT1B1)*

### Notes on the sheet
- Title
- FileName:
- Version:
- Date:
- Project
- Designed By:
- Descriptions:
- Sheet:
- of
- (in symbol CE_SMD) +

### Library data of the parts
C5 C32 = CE_SMD: 贴片电解电容 C4054381; 版权归属: 封装库来自淘宝 ID：黄晶宝石; BOM名称: 贴片电解电容; 联系售后: https://shop463601444.taobao.com
C33-C35 = C: as C1 on sheet 24V_Supply; 联系售后，技术支持: https://shop463601444.taobao.com; 唯一出售店铺网址: https://shop463601444.taobao.com
R39-R46 = R: as R1 on sheet 24V_Supply; BOM名称: 贴片电阻; 联系售后: https://shop463601444.taobao.com
U8 = Micro SD: Micro SD卡; 版权归属: 源创客; BOM名称: Micro SD卡; 学习资源: www.ooocke.com
V2 = AMS1117: as V1 on sheet 5V_and_3V3; 欢迎光临淘宝店铺: https://shop463601444.taobao.com

## Sheet LCD_Screen.SchDoc: LCD Touch Screen Display & Interaction
size A4; DocumentNumber: 14; SheetNumber: 14; SheetTotal: 16
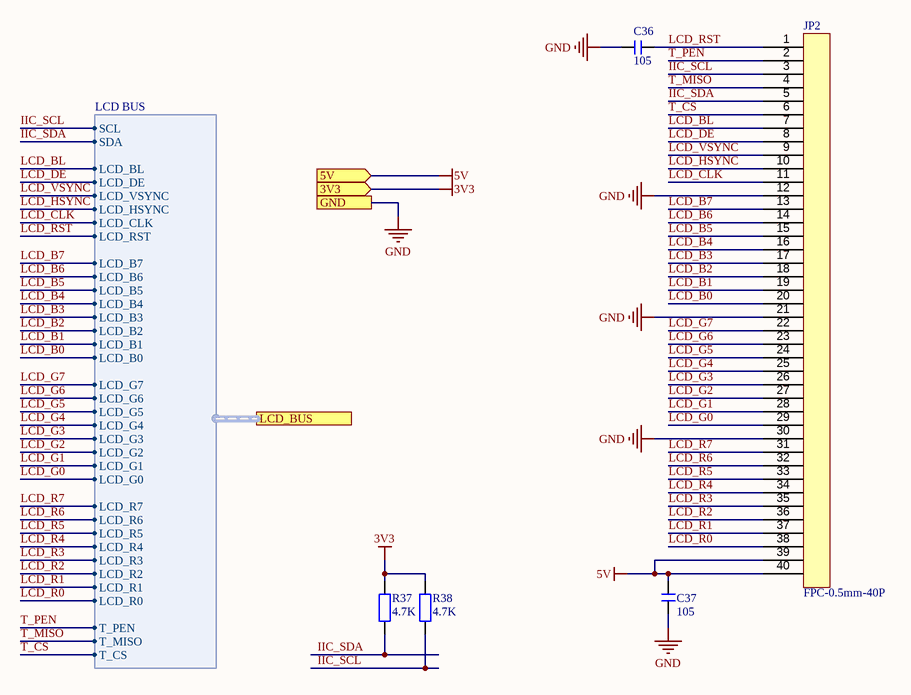
[diagram p14: LCD_Screen.SchDoc]

### Parts
C36  105  [C 0603_L]
C37  105  [C 0603_L]
JP2  FPC-0.5mm-40P  [FPC0.5 2H-WS-40P]
R37  4.7K  [R 0603_L]
R38  4.7K  [R 0603_L]

### Ports
3V3 (in), 5V (in), GND, LCD_BUS (harness LCD BUS)

### Harnesses
LCD BUS: SCL, SDA, LCD_R0, LCD_R1, LCD_R2, LCD_R3, LCD_R4, LCD_R5, LCD_R6, LCD_R7, LCD_G0, LCD_G1, LCD_G2, LCD_G3, LCD_G4, LCD_G5, LCD_G6, LCD_G7, LCD_B0, LCD_B1, LCD_B2, LCD_B3, LCD_B4, LCD_B5, LCD_B6, LCD_B7, LCD_RST, LCD_CLK, LCD_HSYNC, LCD_VSYNC, LCD_DE, LCD_BL, T_PEN, T_MISO, T_CS

### Nets
3V3: R37.2 R38.2 ; port 3V3
5V: C37.2 JP2.39 JP2.40 ; port 5V
GND: C36.2 C37.1 JP2.12 JP2.21 JP2.30 ; port GND
IIC_SCL: JP2.3 R38.1 ; port LCD_BUS.SCL
IIC_SDA: JP2.5 R37.1 ; port LCD_BUS.SDA
LCD_B0: JP2.20 ; port LCD_BUS.LCD_B0
LCD_B1: JP2.19 ; port LCD_BUS.LCD_B1
LCD_B2: JP2.18 ; port LCD_BUS.LCD_B2
LCD_B3: JP2.17 ; port LCD_BUS.LCD_B3
LCD_B4: JP2.16 ; port LCD_BUS.LCD_B4
LCD_B5: JP2.15 ; port LCD_BUS.LCD_B5
LCD_B6: JP2.14 ; port LCD_BUS.LCD_B6
LCD_B7: JP2.13 ; port LCD_BUS.LCD_B7
LCD_BL: JP2.7 ; port LCD_BUS.LCD_BL
LCD_CLK: JP2.11 ; port LCD_BUS.LCD_CLK
LCD_DE: JP2.8 ; port LCD_BUS.LCD_DE
LCD_G0: JP2.29 ; port LCD_BUS.LCD_G0
LCD_G1: JP2.28 ; port LCD_BUS.LCD_G1
LCD_G2: JP2.27 ; port LCD_BUS.LCD_G2
LCD_G3: JP2.26 ; port LCD_BUS.LCD_G3
LCD_G4: JP2.25 ; port LCD_BUS.LCD_G4
LCD_G5: JP2.24 ; port LCD_BUS.LCD_G5
LCD_G6: JP2.23 ; port LCD_BUS.LCD_G6
LCD_G7: JP2.22 ; port LCD_BUS.LCD_G7
LCD_HSYNC: JP2.10 ; port LCD_BUS.LCD_HSYNC
LCD_R0: JP2.38 ; port LCD_BUS.LCD_R0
LCD_R1: JP2.37 ; port LCD_BUS.LCD_R1
LCD_R2: JP2.36 ; port LCD_BUS.LCD_R2
LCD_R3: JP2.35 ; port LCD_BUS.LCD_R3
LCD_R4: JP2.34 ; port LCD_BUS.LCD_R4
LCD_R5: JP2.33 ; port LCD_BUS.LCD_R5
LCD_R6: JP2.32 ; port LCD_BUS.LCD_R6
LCD_R7: JP2.31 ; port LCD_BUS.LCD_R7
LCD_RST: C36.1 JP2.1 ; port LCD_BUS.LCD_RST
LCD_VSYNC: JP2.9 ; port LCD_BUS.LCD_VSYNC
T_CS: JP2.6 ; port LCD_BUS.T_CS
T_MISO: JP2.4 ; port LCD_BUS.T_MISO
T_PEN: JP2.2 ; port LCD_BUS.T_PEN

### Notes on the sheet
- Title
- FileName:
- Version:
- Date:
- Project
- Designed By:
- Descriptions:
- Sheet:
- of

### Library data of the parts
C36 C37 = C: as C1 on sheet 24V_Supply; 联系售后，技术支持: https://shop463601444.taobao.com; 唯一出售店铺网址: https://shop463601444.taobao.com
JP2 = FPC-0.5mm-40P: FPC Connector 0.5mm 40PIN
R37 R38 = R: as R1 on sheet 24V_Supply; BOM名称: 贴片电阻; 联系售后: https://shop463601444.taobao.com

## Sheet Misc.SchDoc: Miscellaneous Peripherals (Button, LED, GPIO, etc.)
size A4; DocumentNumber: 16; SheetNumber: 16; SheetTotal: 16
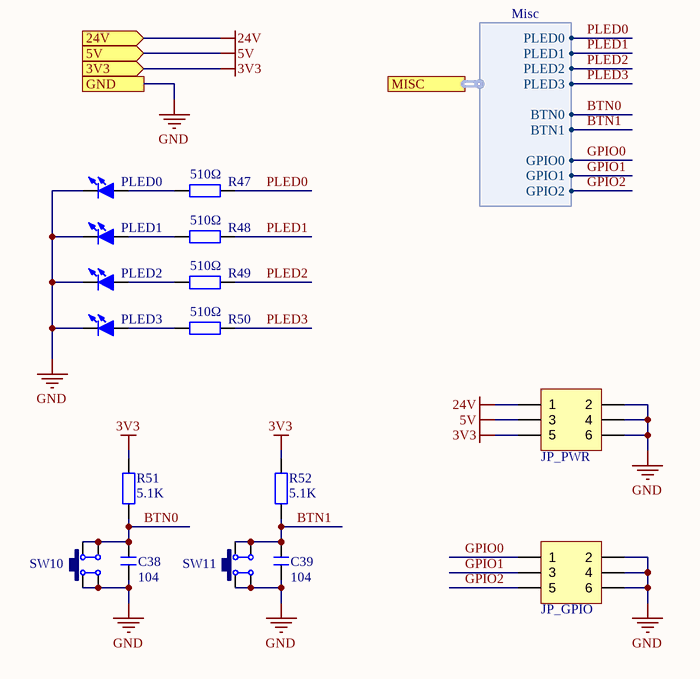
[diagram p15: Misc.SchDoc]

### Parts
C38  104  [C 0603_L]
C39  104  [C 0603_L]
JP_GPIO  Header3X2  [HDR2.54-LI-2x3P]  (value not drawn)
JP_PWR  Header3X2  [HDR2.54-LI-2x3P]  (value not drawn)
PLED0  Green  [LED 0603G]  (value not drawn)
PLED1  Green  [LED 0603G]  (value not drawn)
PLED2  Green  [LED 0603G]  (value not drawn)
PLED3  Green  [LED 0603G]  (value not drawn)
R47  510Ω  [R 0603_L]
R48  510Ω  [R 0603_L]
R49  510Ω  [R 0603_L]
R50  510Ω  [R 0603_L]
R51  5.1K  [R 0603_L]
R52  5.1K  [R 0603_L]
SW10  6x6x5  [TSW SMD-6*6*4.3]  (value not drawn)
SW11  6x6x5  [TSW SMD-6*6*4.3]  (value not drawn)

### Ports
3V3 (in), 5V (in), 24V (in), GND, MISC (harness Misc)

### Harnesses
Misc: PLED0, PLED1, PLED2, PLED3, BTN1, BTN0, GPIO0, GPIO1, GPIO2

### Nets
3V3: JP_PWR.5 R51.2 R52.2 ; port 3V3
5V: JP_PWR.3 ; port 5V
24V: JP_PWR.1 ; port 24V
GND: C38.1 C39.1 JP_GPIO.2 JP_GPIO.4 JP_GPIO.6 JP_PWR.2 JP_PWR.4 JP_PWR.6 PLED0.2(K) PLED1.2(K) PLED2.2(K) PLED3.2(K) SW10.1 SW10.4 SW11.1 SW11.4 ; port GND
BTN0: C38.2 R51.1 SW10.2 SW10.3 ; port MISC.BTN0
BTN1: C39.2 R52.1 SW11.2 SW11.3 ; port MISC.BTN1
GPIO0: JP_GPIO.1 ; port MISC.GPIO0
GPIO1: JP_GPIO.3 ; port MISC.GPIO1
GPIO2: JP_GPIO.5 ; port MISC.GPIO2
PLED0: R47.2 ; port MISC.PLED0
PLED1: R48.2 ; port MISC.PLED1
PLED2: R49.2 ; port MISC.PLED2
PLED3: R50.2 ; port MISC.PLED3
NetPLED0_1: PLED0.1(A) R47.1
NetPLED1_1: PLED1.1(A) R48.1
NetPLED2_1: PLED2.1(A) R49.1
NetPLED3_1: PLED3.1(A) R50.1

### Notes on the sheet
- Title
- FileName:
- Version:
- Date:
- Project
- Designed By:
- Descriptions:
- Sheet:
- of

### Library data of the parts
C38 C39 = C: as C1 on sheet 24V_Supply; 联系售后，技术支持: https://shop463601444.taobao.com; 唯一出售店铺网址: https://shop463601444.taobao.com
JP_GPIO JP_PWR = Header 3X2: 3*2P接插件; 版权归属: 封装库来自淘宝 ID：黄晶宝石; BOM名称: 3*2P接插件; 学习资源: https://shop463601444.taobao.com
PLED0-PLED3 = LED-SMD: 贴片LED; 版权归属: 封装库来自淘宝 ID：黄晶宝石; BOM名称: 贴片LED; 学习资源: https://shop463601444.taobao.com
R47-R52 = R: as R1 on sheet 24V_Supply; BOM名称: 贴片电阻; 联系售后: https://shop463601444.taobao.com
SW10 SW11 = TSW SMD-6x6: 贴片6x6轻触开关 / C3010208; 版权归属: 封装库来自淘宝 ID：黄晶宝石; BOM名称: 贴片6x6轻触开关; 唯一出售店铺网址: https://shop463601444.taobao.com